# Altium project radxa_cm3i_io_board_v1.4.PrjPcb (part 1 of 4)
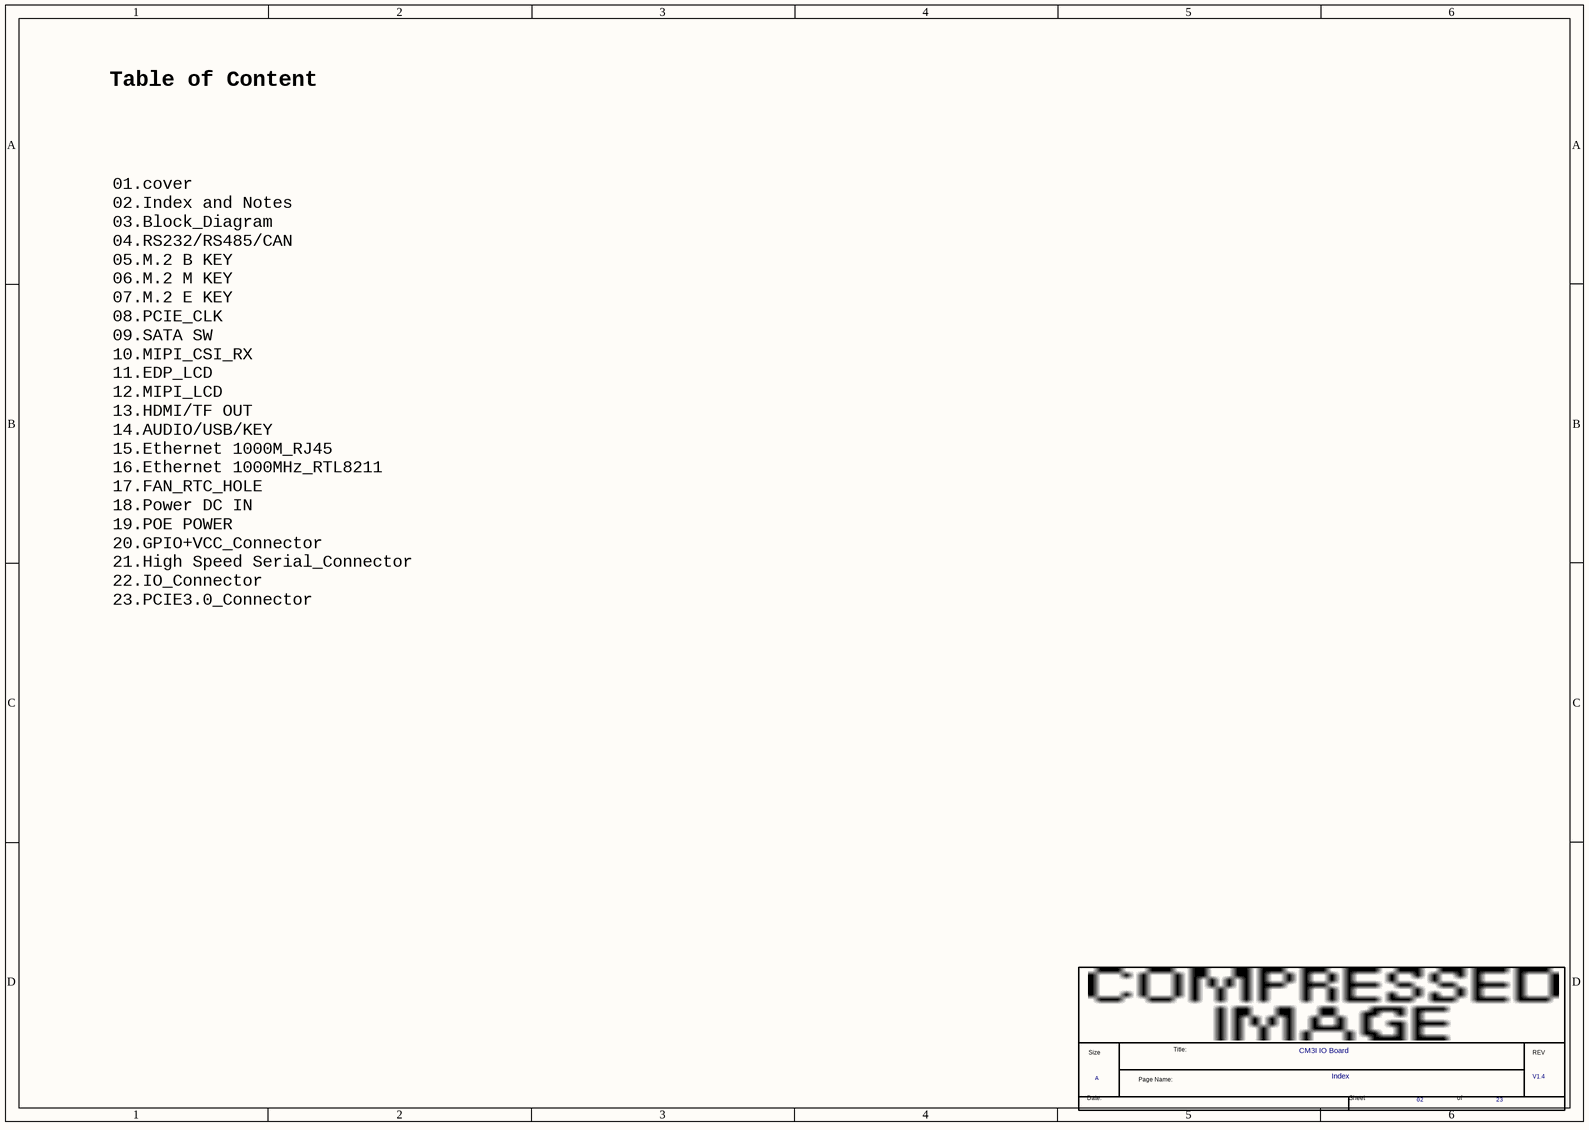
[diagram p0: 02.SchDoc]
23 sheets, 746 parts. Net scope: flat (ports and power ports of the same name join across sheets).
Sheets:
  01.SchDoc
  02.SchDoc
  03.SchDoc
  04.SchDoc
  05.SchDoc
  06.SchDoc
  07.SchDoc
  08.SchDoc
  09.SchDoc
  10.SchDoc
  11.SchDoc
  12.SchDoc
  13.SchDoc
  14.SchDoc
  15.SchDoc
  16.SchDoc
  17.SchDoc
  18.SchDoc
  19.SchDoc
  20.SchDoc
  21.SchDoc
  22.SchDoc
  23.SchDoc

## Sheet 01.SchDoc
size 297 x 209 mm

## Sheet 02.SchDoc
size 297 x 209 mm

### Parts
(Parts that share a designator on the sheet are numbered #1, #2 ... from top to bottom, then left to right.)
*#1  Page Count: 23  Page Number: 02  Page Size: A  Title: CM3I IO Board  RevCode: V1.4  Doc: Index  (hidden comment: radxa_1010)  (graphical)

### Notes on the sheet
- Table of Content
- 01.cover
  02.Index and Notes
  03.Block_Diagram
  04.RS232/RS485/CAN
  05.M.2 B KEY
  06.M.2 M KEY
  07.M.2 E KEY
  08.PCIE_CLK
  09.SATA SW
  10.MIPI_CSI_RX
  11.EDP_LCD
  12.MIPI_LCD
  13.HDMI/TF OUT
  14.AUDIO/USB/KEY
  15.Ethernet 1000M_RJ45
  16.Ethernet 1000MHz_RTL8211
  17.FAN_RTC_HOLE
  18.Power DC IN
  19.POE POWER
  20.GPIO+VCC_Connector
  21.High Speed Serial_Connector
  22.IO_Connector
  23.PCIE3.0_Connector
- (in symbol radxa_1010) Title:; Size; REV; Page Name:; Date:; Sheet; of

### Library data of the parts
*#1 = radxa_1010: Page Create Date: March  8, 1995

## Sheet 03.SchDoc
size 420 x 297 mm
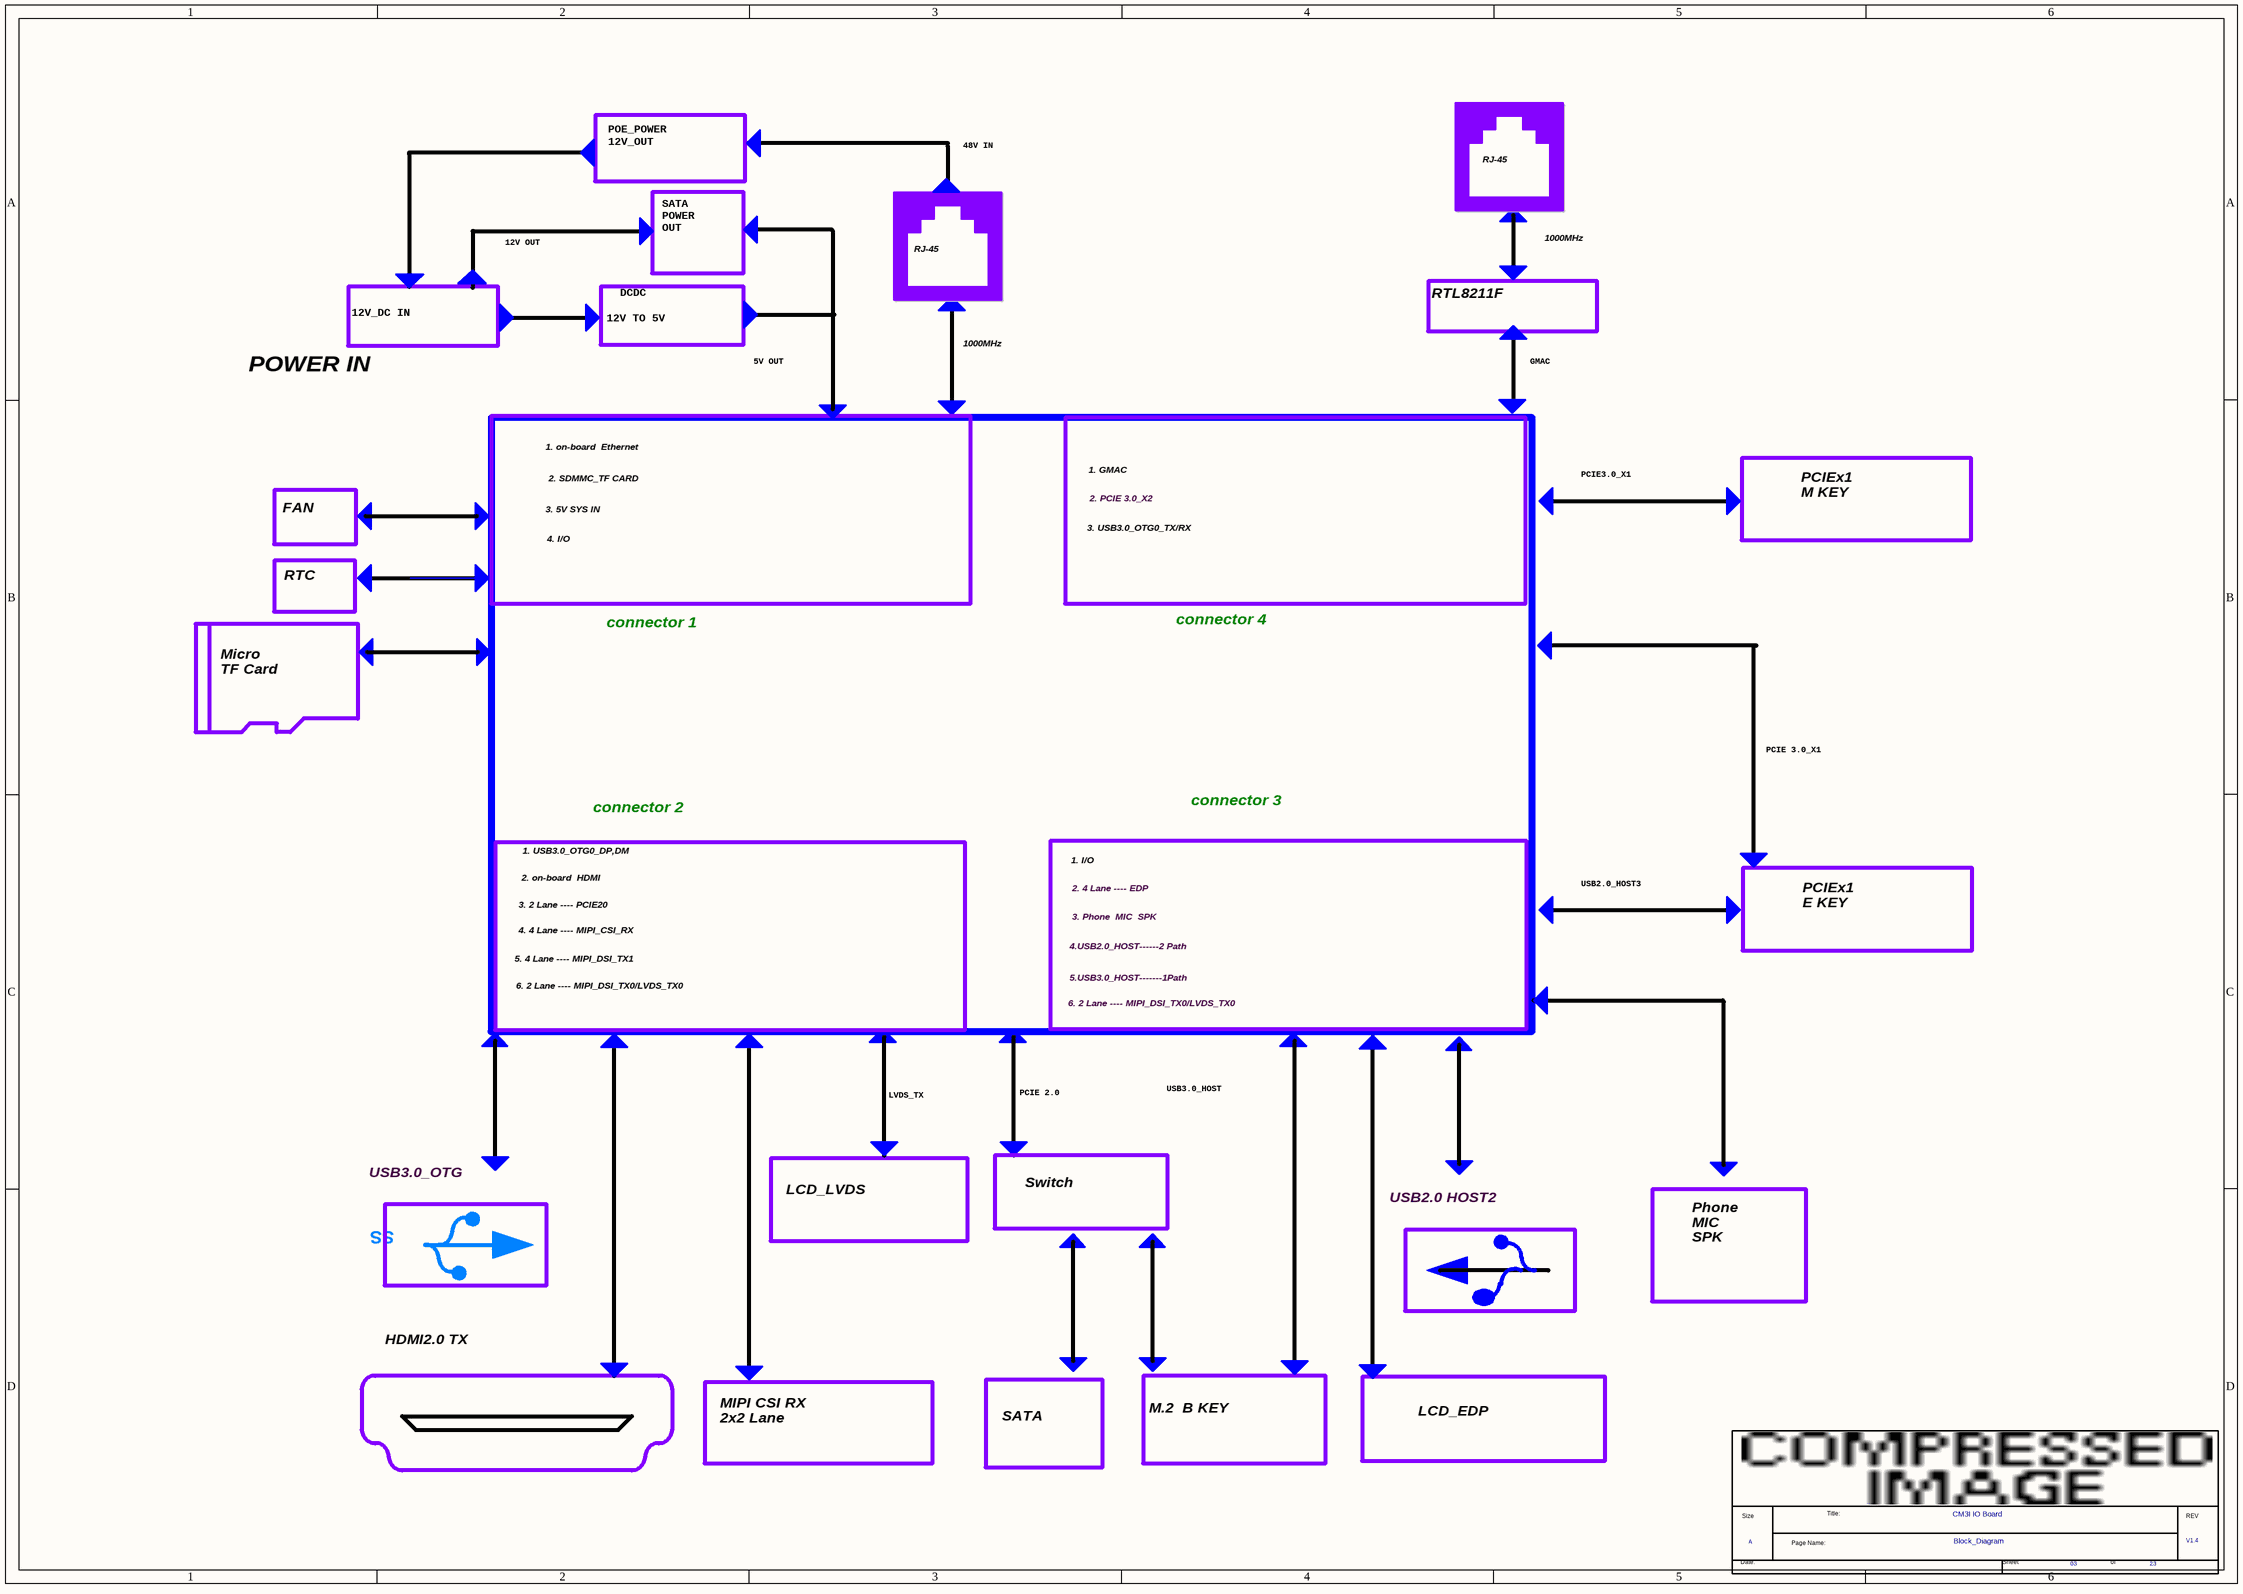
[diagram p1: 03.SchDoc]

### Parts
(Parts that share a designator on the sheet are numbered #1, #2 ... from top to bottom, then left to right.)
*#2  Page Count: 23  Page Number: 03  Page Size: A  Title: CM3I IO Board  RevCode: V1.4  Doc: Block_Diagram  (hidden comment: radxa_1010)  (graphical)

### Notes on the sheet
- POE_POWER
  12V_OUT
- SATA
  POWER
  OUT
- 48V IN
- RJ-45
- 12V OUT
- 1000MHz
- 12V_DC IN
- 12V TO 5V
- DCDC
- RTL8211F
- POWER IN
- 5V OUT
- GMAC
- 1. on-board  Ethernet
- PCIEx1
  M KEY
- FAN
- 3. 5V SYS IN
- 2. SDMMC_TF CARD
- 3. USB3.0_OTG0_TX/RX
- 1. GMAC
- 2. PCIE 3.0_X2
- PCIE3.0_X1
- RTC
- 4. I/O
- Micro
  TF Card
- connector 1
- connector 4
- PCIE 3.0_X1
- 1. USB3.0_OTG0_DP,DM
- connector 2
- 1. I/O
- connector 3
- 4. 4 Lane ---- MIPI_CSI_RX
- 3. 2 Lane ---- PCIE20
- 2. on-board  HDMI
- 2. 4 Lane ---- EDP
- 3. Phone  MIC  SPK
- USB2.0_HOST3
- PCIEx1
  E KEY
- 5. 4 Lane ---- MIPI_DSI_TX1
- 6. 2 Lane ---- MIPI_DSI_TX0/LVDS_TX0
- 4.USB2.0_HOST------2 Path
- 5.USB3.0_HOST-------1Path
- LVDS_TX
- PCIE 2.0
- USB3.0_HOST
- USB3.0_OTG
- LCD_LVDS
- Switch
- USB2.0 HOST2
- Phone
  MIC
  SPK
- SS
- HDMI2.0 TX
- MIPI CSI RX
  2x2 Lane
- SATA
- M.2  B KEY
- LCD_EDP
- (in symbol radxa_1010) Title:; Size; REV; Page Name:; Date:; Sheet; of

### Library data of the parts
*#2 = radxa_1010: Page Create Date: March  8, 1995

## Sheet 04.SchDoc
size 420 x 297 mm
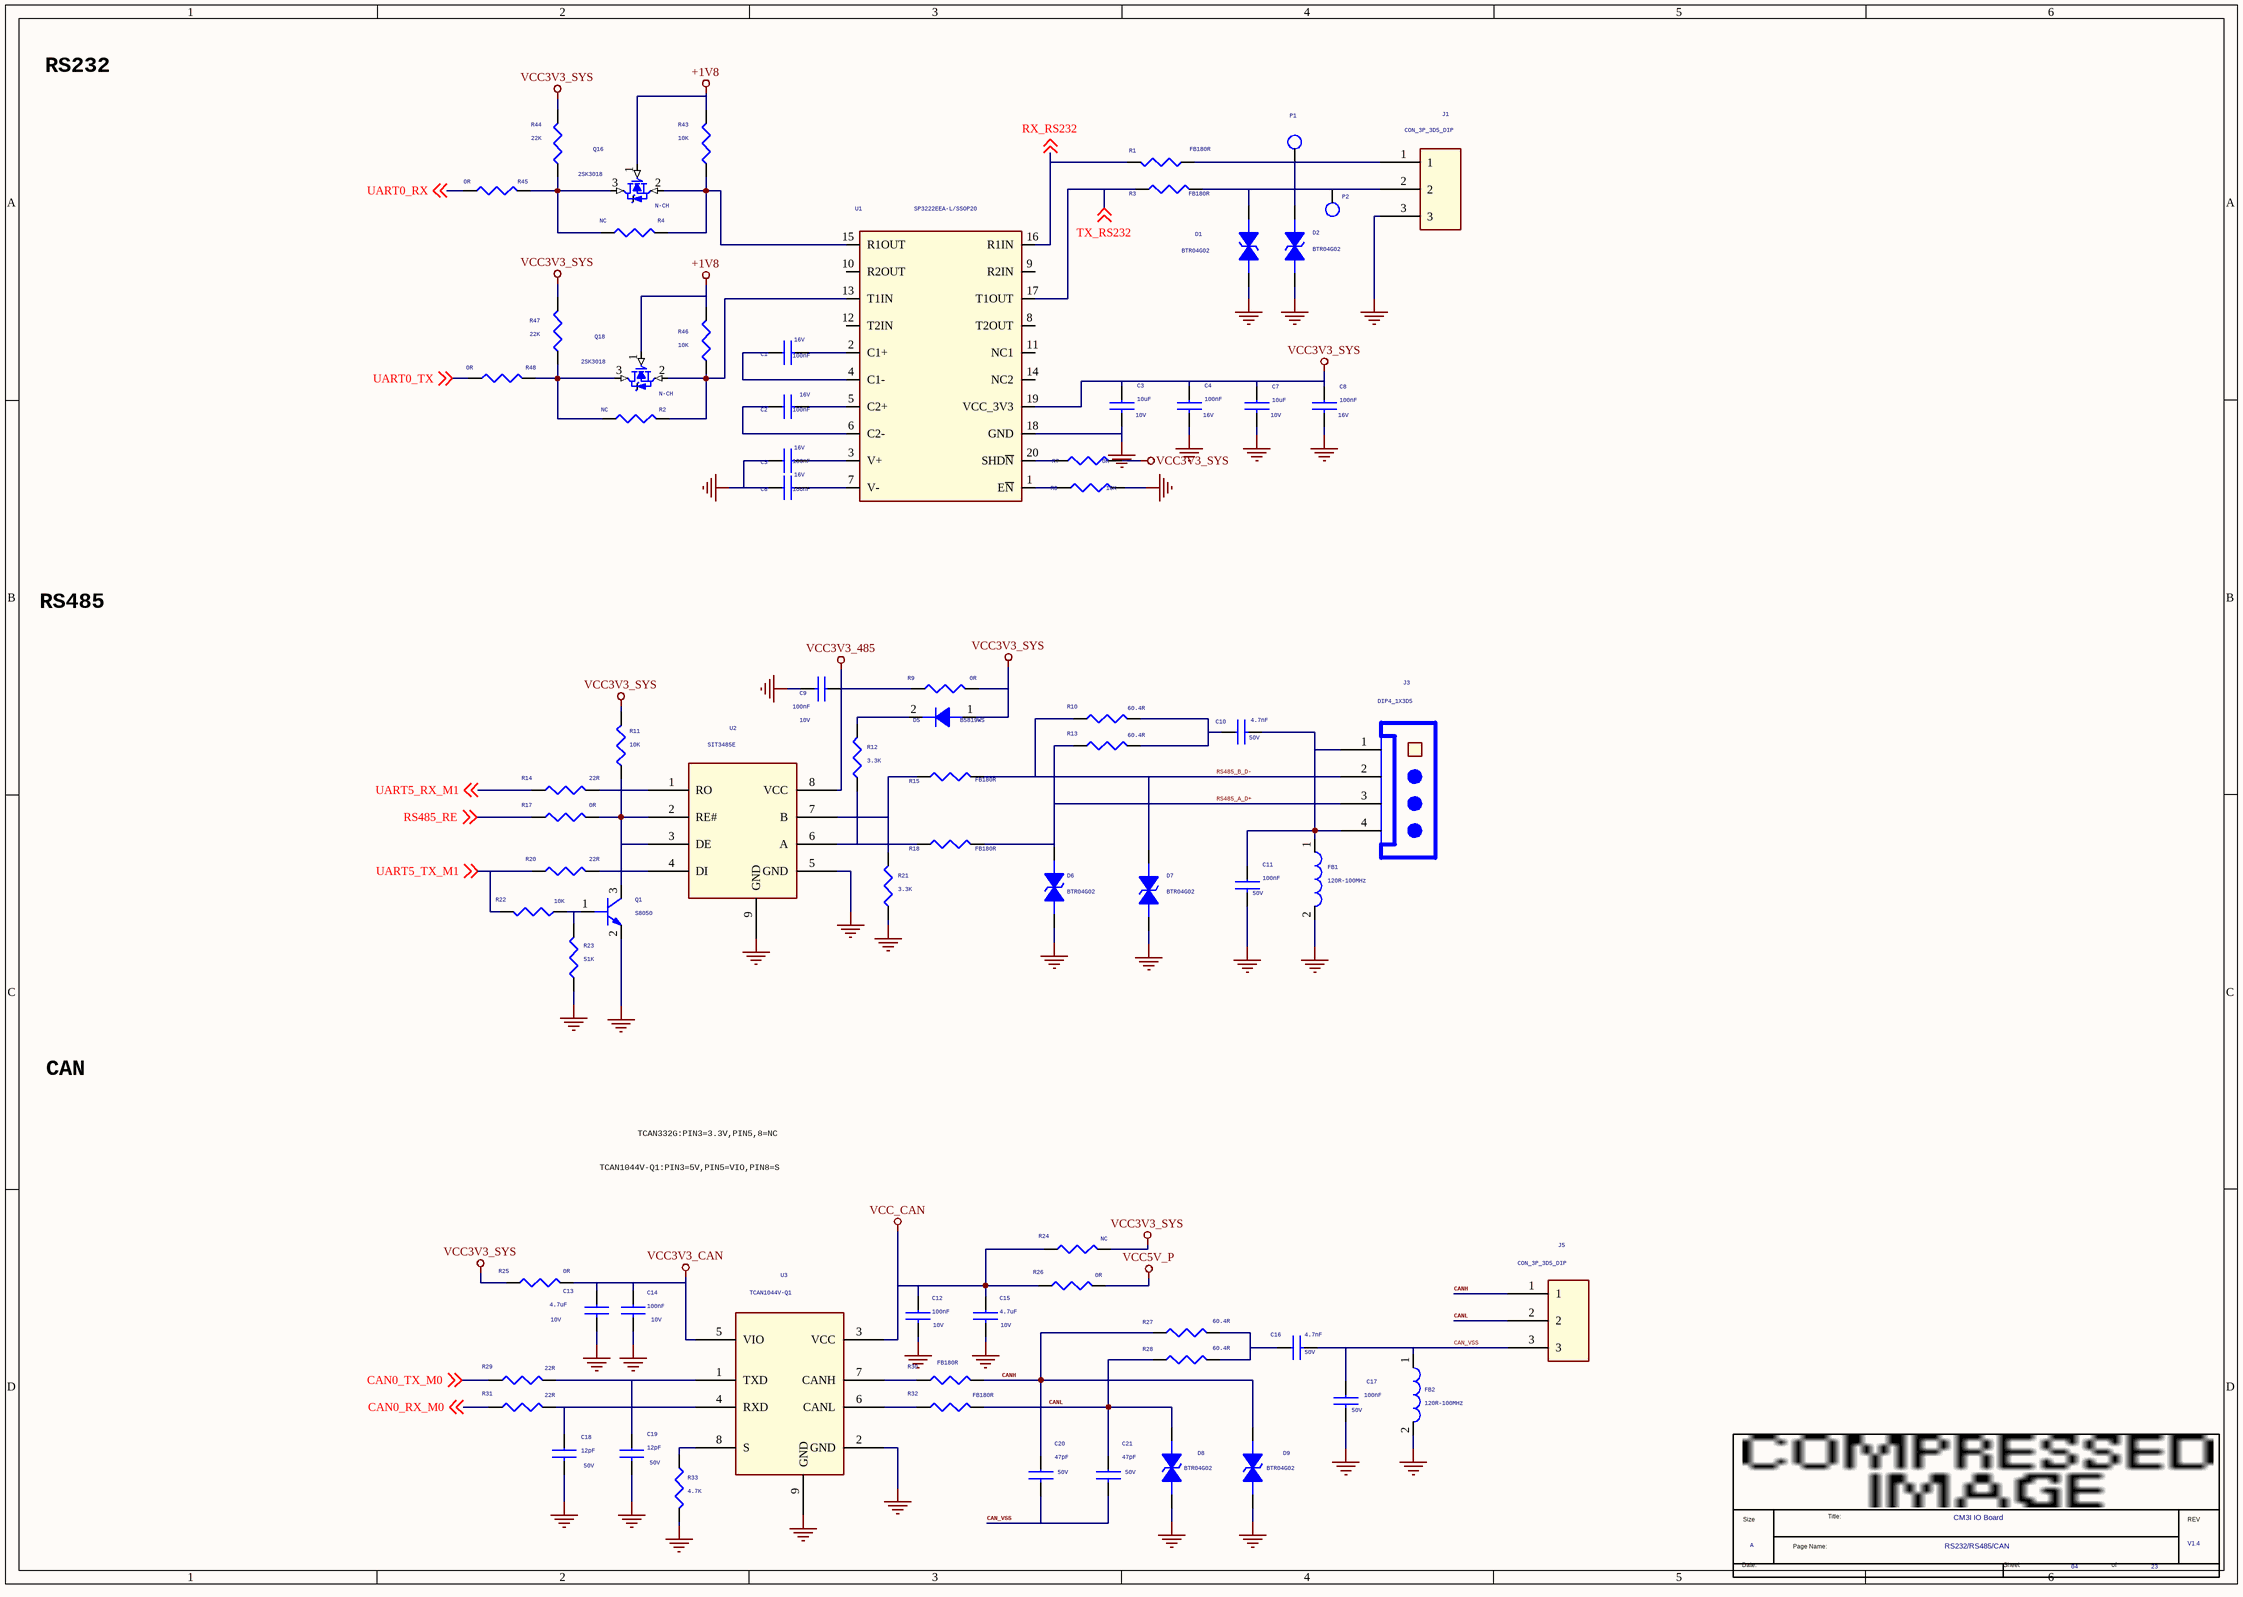
[diagram p2: 04.SchDoc]

### Parts
(Parts that share a designator on the sheet are numbered #1, #2 ... from top to bottom, then left to right.)
*#3  Page Count: 23  Page Number: 04  Page Size: A  Title: CM3I IO Board  RevCode: V1.4  Doc: RS232/RS485/CAN  (hidden comment: radxa_1010)  (graphical)
C1  100nF  Voltage: 16V  [C0402]
C2  100nF  Voltage: 16V  [C0402]
C3  10uF  Voltage: 10V  [C0603]
C4  100nF  Voltage: 16V  [C0402]
C5  100nF  Voltage: 16V  [C0402]
C6  100nF  Voltage: 16V  [C0402]
C7  10uF  Voltage: 10V  [C0603]
C8  100nF  Voltage: 16V  [C0402]
C9  100nF  Voltage: 10V  [C0402]
C10  4.7nF  Voltage: 50V  [C0402]
C11  100nF  Voltage: 50V  [C0603]
C12  100nF  Voltage: 10V  [C0402]
C13  4.7uF  Voltage: 10V  [C0603]
C14  100nF  Voltage: 10V  [C0402]
C15  4.7uF  Voltage: 10V  [C0603]
C16  4.7nF  Voltage: 50V  [C0402]
C17  100nF  Voltage: 50V  [C0603]
C18  12pF  Voltage: 50V  [C0402]
C19  12pF  Voltage: 50V  [C0402]
C20  47pF  Voltage: 50V  [C0402]
C21  47pF  Voltage: 50V  [C0402]
D1  BTR04G02  [ESD0402_1xD5]
D2  BTR04G02  [ESD0402_1xD5]
D5  B5819WS  [SOD_323]
D6  BTR04G02  [ESD0402_1xD5]
D7  BTR04G02  [ESD0402_1xD5]
D8  BTR04G02  [ESD0402_1xD5]
D9  BTR04G02  [ESD0402_1xD5]
FB1  120R-100MHz  [L0603]
FB2  120R-100MHz  [L0603]
J1  CON_3P_3D5_DIP  [DIP3_1X3_2R54]
J3  DIP4_1X3D5  [DIP4_1X3D5]
J5  CON_3P_3D5_DIP  [DIP3_1X3_2R54]
P1  TEST  [TEST]  (value not drawn)
P2  TEST  [TEST]  (value not drawn)
Q1  S8050  [SOT_23]
Q16  2SK3018  [S0T-23]
Q18  2SK3018  [S0T-23]
R1  FB180R  [R0402]
R2  NC  [R0402]
R3  FB180R  [R0402]
R4  NC  [R0402]
R7  0R  [R0402]
R8  10K  [R0402]
R9  0R  [R0402]
R10  60.4R  [R0402]
R11  10K  [R0402]
R12  3.3K  [R0402]
R13  60.4R  [R0402]
R14  22R  [R0402]
R15  FB180R  [R0402]
R17  0R  [R0402]
R18  FB180R  [R0402]
R20  22R  [R0402]
R21  3.3K  [R0402]
R22  10K  [R0402]
R23  51K  [R0402]
R24  NC  [R0402]
R25  0R  [R0402]
R26  0R  [R0402]
R27  60.4R  [R0402]
R28  60.4R  [R0402]
R29  22R  [R0402]
R30  FB180R  [R0402]
R31  22R  [R0402]
R32  FB180R  [R0402]
R33  4.7K  [R0402]
R43  10K  [R0402]
R44  22K  [R0402]
R45  0R  [R0402]
R46  10K  [R0402]
R47  22K  [R0402]
R48  0R  [R0402]
U1  SP3222EEA-L/SSOP20  [SSOP20_1]
U2  SIT3485E  [SOP8_5R00X4R00X1R75_T]
U3  TCAN1044V-Q1  [SOP8_5R00X4R00X1R75_T]

### Nets
+1V8: Q16.1(G) Q18.1(G) R43.1 R46.1
GND: C3.2 C4.2 C5.1 C6.1 C7.2 C8.2 C9.2 C11.2 C12.2 C13.2 C14.2 C15.2 C17.2 C18.2 C19.2 D1.1 D2.1 D6.1 D7.1 D8.1 D9.1 FB1.2 FB2.2 J1.3 Q1.2(EMITTER) R8.2 R21.2 R23.2 R33.2 U1.18(GND) U2.5(GND) U2.9(GND) U3.2(GND) U3.9(GND)
VCC3V3_485: C9.1 R9.1 U2.8(VCC)
VCC3V3_CAN: C13.1 C14.1 R25.2 U3.5(VIO)
VCC3V3_SYS: C3.1 C4.1 C7.1 C8.1 D5.1(A) R7.1 R9.2 R11.1 R24.2 R25.1 R44.1 R47.1 U1.19(VCC_3V3)
VCC5V_P: R26.2
VCC_CAN: C12.1 C15.1 R24.1 R26.1 U3.3(VCC)
CAN0_RX_M0: R31.1 ; off-sheet CAN0_RX_M0
CAN0_TX_M0: R29.1 ; off-sheet CAN0_TX_M0
CAN_VSS: C16.2 C17.1 C20.2 C21.2 FB2.1 J5.3
CANH: C20.1 D9.2 J5.1 R27.1 R30.2
CANL: C21.1 D8.2 J5.2 R28.1 R32.2
RS485_A_D+: D6.2 J3.3(TX) R13.1 R18.2
RS485_B_D-: D7.2 J3.2(RX) R10.1 R15.2
RS485_RE: R17.1 ; off-sheet RS485_RE
RX_RS232: R1.2 U1.16(R1IN) ; off-sheet RX_RS232
TX_RS232: R3.2 U1.17(T1OUT) ; off-sheet TX_RS232
UART0_RX: R45.2 ; off-sheet UART0_RX
UART0_TX: R48.2 ; off-sheet UART0_TX
UART5_RX_M1: R14.1 ; off-sheet UART5_RX_M1
UART5_TX_M1: R20.1 R22.1 ; off-sheet UART5_TX_M1
NetC1_1: C1.1 U1.4(C1-)
NetC1_2: C1.2 U1.2(C1+)
NetC2_1: C2.1 U1.6(C2-)
NetC2_2: C2.2 U1.5(C2+)
NetC5_2: C5.2 U1.3(V+)
NetC6_2: C6.2 U1.7(V-)
NetC10_1: C10.1 R10.2 R13.2
NetC10_2: C10.2 C11.1 FB1.1 J3.1(GND) J3.4(3V3)
NetC16_1: C16.1 R27.2 R28.2
NetC18_1: C18.1 R31.2 U3.4(RXD)
NetC19_1: C19.1 R29.2 U3.1(TXD)
NetD1_2: D1.2 J1.2 P2.1 R3.1
NetD2_2: D2.2 J1.1 P1.1 R1.1
NetD5_2: D5.2(K) R12.1
NetQ1_1: Q1.1(BASE) R22.2 R23.1
NetQ1_3: Q1.3(COLLECTOR) R11.2 R17.2 U2.2(RE#) U2.3(DE)
NetQ16_2: Q16.2(S) R4.1 R43.2 U1.15(R1OUT)
NetQ16_3: Q16.3(D) R4.2 R44.2 R45.1
NetQ18_2: Q18.2(S) R2.1 R46.2 U1.13(T1IN)
NetQ18_3: Q18.3(D) R2.2 R47.2 R48.1
NetR7_2: R7.2 U1.20(SHD~{N})
NetR8_1: R8.1 U1.1(E~{N})
NetR12_2: R12.2 R18.1 U2.6(A)
NetR14_2: R14.2 U2.1(RO)
NetR15_1: R15.1 R21.1 U2.7(B)
NetR20_2: R20.2 U2.4(DI)
NetR30_1: R30.1 U3.7(CANH)
NetR32_1: R32.1 U3.6(CANL)
NetR33_1: R33.1 U3.8(S)

Not connected (* = marked no-connect by the designer): U1 8(T2OUT) 9(R2IN) 10(R2OUT) 11(NC1) 12(T2IN) 14(NC2)

### Notes on the sheet
- RS232
- RS485
- CAN
- TCAN332G:PIN3=3.3V,PIN5,8=NC
- TCAN1044V-Q1:PIN3=5V,PIN5=VIO,PIN8=S
- (in symbol N-MOSFET) N-CH
- (in symbol radxa_1010) Size; Title:; REV; Page Name:; Date:; Sheet; of

### Library data of the parts
C1 C2 = CAP NP_0: cap,100.00nF,+/-10%,16V,X5R,C0402; Manufacturer: TDK; RK PN: C1005X5R1C104K050BA; Priority: A; Tolerance: 10%; Dielectric: X5R; Part Type: C0402; Manufacturer PN: C1005X5R1C104K050BA; Created by: JJJ
C3 C15 = CAP NP_0: cap,4.70uF,+/-10%,10V,X5R,C0603; Manufacturer: TDK; RK PN: C1608X5R1A475K080AC; Priority: A; Tolerance: 10%; Dielectric: X5R; Part Type: C0603; Manufacturer PN: C1608X5R1A475K080AC; Created by: JJJ
C4-C6 C8 = CAP NP_0: cap,100.00nF,+/-10%,16V,X5R,C0402; Manufacturer PN: C1005X5R1C104K050BA; Manufacturer: TDK; Tolerance: 10%; Priority: A; Dielectric: X5R; Created by: JJJ; Part Type: C0402; RK PN: C1005X5R1C104K050BA
C7 = CAP NP_0: cap,4.70uF,+/-10%,10V,X5R,C0603; Manufacturer PN: C1608X5R1A475K080AC; Manufacturer: TDK; Tolerance: 10%; Priority: A; Dielectric: X5R; Created by: JJJ; Part Type: C0603; RK PN: C1608X5R1A475K080AC
C9 = CAP NP_0: cap,100.00nF,+/-10%,10V,X5R,C0402; Manufacturer: TDK; Number: 37; RK PN: C1005X5R1A104K050BA; Priority: A; Tolerance: 10%; C_Voltage: 6.3V; Dielectric: X5R; Part Type: C0402; Manufacturer PN: C1005X5R1A104K050BA; Created by: JJJ
C10 C16 = CAP NP_0: cap,4.70nF,+/-10%,50V,X5R,C0402; Manufacturer PN: C1005X5R1H472K050BA; Manufacturer: TDK; Tolerance: 10%; Priority: A; Dielectric: X5R; Created by: JJJ; C_Voltage: 50V; Part Type: C0402; RK PN: C1005X5R1H472K050BA
C11 = CAP NP_0: cap,100.00nF,+/-10%,50V,X5R,C0603; Manufacturer: TDK; RK PN: C1608X5R1H104K080AA; Priority: A; C_Voltage: 6.3V; Tolerance: 10%; Dielectric: X5R; Part Type: C0603; Manufacturer PN: C1608X5R1H104K080AA; Created by: JJJ
C12 C14 = CAP NP_0: cap,100.00nF,+/-10%,10V,X5R,C0402; Manufacturer PN: C1005X5R1A104K050BA; Manufacturer: TDK; Tolerance: 10%; Priority: A; Dielectric: X5R; Created by: JJJ; Part Type: C0402; RK PN: C1005X5R1A104K050BA
C13 = CAP NP_0: cap,4.70uF,+/-10%,10V,X5R,C0603; Manufacturer: TDK; RK PN: C1608X5R1A475K080AC; Tolerance: 10%; Priority: A; Dielectric: X5R; Created by: JJJ; Part Type: C0603; Manufacturer PN: C1608X5R1A475K080AC
C17 = CAP NP_0: cap,100.00nF,+/-10%,50V,X5R,C0603; Manufacturer PN: C1608X5R1H104K080AA; Manufacturer: TDK; Tolerance: 10%; C_Voltage: 6.3V; Priority: A; Dielectric: X5R; Created by: JJJ; Part Type: C0603; RK PN: C1608X5R1H104K080AA
C18 C19 = CAP NP_0: cap,12.00pF,+/-5%,50V,C0G,C0402; Manufacturer PN: C1005C0G1H120J050BA; Manufacturer: TDK; Tolerance: 5%; Priority: A; OPTION: DNP; Dielectric: C0G; Created by: JJJ; C_Voltage: 50V; Part Type: C0402; RK PN: C1005C0G1H120J050BA
C20 C21 = CAP NP_0: cap,47.00pF,+/-5%,50V,C0G,C0402; Manufacturer: TDK; RK PN: C1005C0G1H470J050BA; Priority: A; Tolerance: 5%; OPTION: DNP; Dielectric: C0G; Part Type: C0402; C_Voltage: 50V; Manufacturer PN: C1005C0G1H470J050BA; Created by: JJJ
D1 D2 D8 D9 = DIODE BI_DIR TRIG_0: 1-Line, Bi-directional, Transient Voltage Suppressors.17.5pF.; Manufacturer: WillSemi(韦尔半导体); RK PN: ESD5451N; Priority: A; OPTION: DNP; Part Type: ESD_TVS; Manufacturer PN: ESD5451N; Created by: JJJ
D5 = DIODE_Dup2: Schottky Barrier，B5819WS SOD-323; Manufacturer: 长电; Priority: A; RK PN: B5819WS; Part Type: Schottky rectifier; Manufacturer PN: B5819WS; Created by: JJJ
D6 D7 = DIODE BI_DIR TRIG_0: 1-Line, Bi-directional, Transient Voltage Suppressors.17.5pF.; Manufacturer PN: ESD5451N; Manufacturer: WillSemi(韦尔半导体); OPTION: DNP; Priority: A; Created by: JJJ; Part Type: ESD_TVS; RK PN: ESD5451N
FB1 FB2 = BEAD: BEAD,120R@100MHz,current=2000mA,0603; Manufacturer PN: BLM18KG121TN1; Manufacturer: Murata; DC Resistor: 0.030ohm; Tolerance: 25%; Irms: 2A; Priority: L; Created by: DZS; Part Type: BEAD; RK PN: BLM18KG121TN1
J1 J5 = CON3_1X3: 单排3PIN（间距2.54mm）不带防护墙的插针; RK PN: CON3M_1X3_2R54_V; Priority: A; Part Type: Header; Manufacturer Part Number: CON3M_1X3_2R54_V; Created by: JJJ
J3 = CON4_0
P1 P2 = TESTPOINT1
Q1 = NPN: S8050,SOT23; Manufacturer: 长电; Manufacturer PN: S8050_SOT23; OPTION: DNP; Priority: A; Ic: 0.5A; Vceo: 25V; Pc: 0.3W; RK PN: S8050; Part Type: NPN; Created by: JJJ
Q16 Q18 = N-MOSFET: SANZ_P/N: SK2300; Part Type: MOS管
R1 R14 = RESISTOR_0_Dup1: 通用厚膜电阻,22R,+/-5%,R0402,1/16W.; Manufacturer PN: RC0402JR-0722RL; Manufacturer: YAGEO; Tolerance: 5%; Wattage: 1/16W; Priority: A; Created by: YTL; Part Type: 通用厚膜电阻; RK PN: RC0402JR-0722RL
R2 R4 = RESISTOR_2: 通用厚膜电阻,22R,+/-5%,R0402,1/16W.; Manufacturer: YAGEO; Tolerance: 5%; RK PN: RC0402JR-0722RL; Priority: A; Wattage: 1/16W; Part Type: 通用厚膜电阻; Manufacturer PN: RC0402JR-0722RL; Created by: YTL
R3 R7 R20 R29 R31 = RESISTOR_0_Dup1: 通用厚膜电阻,22R,+/-5%,R0402,1/16W.; Manufacturer: YAGEO; Tolerance: 5%; RK PN: RC0402JR-0722RL; Priority: A; Wattage: 1/16W; Part Type: 通用厚膜电阻; Manufacturer PN: RC0402JR-0722RL; Created by: YTL
R8 = RESISTOR_0_Dup1: 通用厚膜电阻,10K,+/-5%,R0402,1/16W.; Manufacturer PN: RC0402JR-0710KL; Manufacturer: YAGEO; Tolerance: 5%; Wattage: 1/16W; Priority: A; Created by: YTL; Part Type: 通用厚膜电阻; RK PN: RC0402JR-0710KL
R9 R26 = RESISTOR_0_Dup1: 通用厚膜电阻,0R,+/-5%,R0402,1/16W.; Manufacturer PN: RC0402JR-070RL; Manufacturer: YAGEO; Tolerance: 5%; Wattage: 1/16W; Priority: A; Created by: YTL; Part Type: 通用厚膜电阻; RK PN: RC0402JR-070RL
R10 R28 = RESISTOR_0_Dup1: 通用厚膜电阻,60R4,+/-1%,R1206,1/4W.; Manufacturer: YAGEO; Tolerance: 1%; RK PN: RC1206FR-0760R4L; Priority: A; Wattage: 1/4W; Part Type: 通用厚膜电阻; Manufacturer PN: RC1206FR-0760R4L; Created by: YTL
R11 = RESISTOR_0_Dup1: 通用厚膜电阻,10K,+/-5%,R0402,1/16W.; Manufacturer PN: RC0402JR-0710KL; Manufacturer: YAGEO; Tolerance: 5%; Wattage: 1/16W; Priority: A; OPTION: DNP; Created by: YTL; Part Type: 通用厚膜电阻; RK PN: RC0402JR-0710KL
R12 = RESISTOR_0_Dup1: 通用厚膜电阻,3K3,+/-5%,R0402,1/16W.; Manufacturer: YAGEO; Tolerance: 5%; RK PN: RC0402JR-073K3L; Priority: A; Wattage: 1/16W; Part Type: 通用厚膜电阻; Manufacturer PN: RC0402JR-073K3L; Created by: YTL
R13 R27 = RESISTOR_0_Dup1: 通用厚膜电阻,60R4,+/-1%,R1206,1/4W.; Manufacturer PN: RC1206FR-0760R4L; Manufacturer: YAGEO; Tolerance: 1%; Wattage: 1/4W; Priority: A; Created by: YTL; Part Type: 通用厚膜电阻; RK PN: RC1206FR-0760R4L
R15 R18 = RESISTOR_0_Dup1: 通用厚膜电阻,0R,+/-5%,R0805,1/8W.; Manufacturer: YAGEO; Tolerance: 5%; RK PN: RC0805JR-070RL; Priority: A; Wattage: 1/8W; Part Type: 通用厚膜电阻; Manufacturer PN: RC0805JR-070RL; Created by: YTL
R17 R25 = RESISTOR_0_Dup1: 通用厚膜电阻,0R,+/-5%,R0402,1/16W.; Manufacturer: YAGEO; Tolerance: 5%; RK PN: RC0402JR-070RL; Priority: A; Wattage: 1/16W; Part Type: 通用厚膜电阻; Manufacturer PN: RC0402JR-070RL; Created by: YTL
R21 = RESISTOR_0_Dup1: 通用厚膜电阻,3K3,+/-5%,R0402,1/16W.; Manufacturer PN: RC0402JR-073K3L; Manufacturer: YAGEO; Tolerance: 5%; Wattage: 1/16W; Priority: A; Created by: YTL; Part Type: 通用厚膜电阻; RK PN: RC0402JR-073K3L
R22 = RESISTOR_0_Dup1: 通用厚膜电阻,10K,+/-5%,R0402,1/16W.; Manufacturer: YAGEO; Tolerance: 5%; OPTION: DNP; RK PN: RC0402JR-0710KL; Priority: A; Wattage: 1/16W; Part Type: 通用厚膜电阻; Manufacturer PN: RC0402JR-0710KL; Created by: YTL
R23 = RESISTOR_0_Dup1: 通用厚膜电阻,51K,+/-5%,R0402,1/16W.; Manufacturer PN: RC0402JR-0751KL; Manufacturer: YAGEO; Tolerance: 5%; OPTION: DNP; Wattage: 1/16W; Priority: A; Created by: YTL; Part Type: 通用厚膜电阻; RK PN: RC0402JR-0751KL
R24 = RESISTOR_0_Dup1: 通用厚膜电阻,0R,+/-5%,R0402,1/16W.; Manufacturer PN: RC0402JR-070RL; Manufacturer: YAGEO; Tolerance: 5%; OPTION: DNP; Wattage: 1/16W; Priority: A; Created by: YTL; Part Type: 通用厚膜电阻; RK PN: RC0402JR-070RL
R30 R32 = RESISTOR_0_Dup1: 通用厚膜电阻,0R,+/-5%,R0805,1/8W.; Manufacturer PN: RC0805JR-070RL; Manufacturer: YAGEO; Tolerance: 5%; Wattage: 1/8W; Priority: A; Created by: YTL; Part Type: 通用厚膜电阻; RK PN: RC0805JR-070RL
R33 = RESISTOR_0_Dup1: 通用厚膜电阻,4K7,+/-5%,R0402,1/16W.; Manufacturer: YAGEO; Tolerance: 5%; RK PN: RC0402JR-074K7L; Priority: A; Wattage: 1/16W; Part Type: 通用厚膜电阻; Manufacturer PN: RC0402JR-074K7L; Created by: YTL
R43 = RESISTOR_0: 通用厚膜电阻,10K,+/-5%,R0402,1/16W.; Manufacturer: YAGEO; Tolerance: 5%; RK PN: RC0402JR-0710KL; Priority: A; Wattage: 1/16W; Part Type: 通用厚膜电阻; Manufacturer PN: RC0402JR-0710KL; Created by: YTL
R44 = RESISTOR_0: 通用厚膜电阻,1K5,+/-5%,R0402,1/16W.; Manufacturer PN: RC0402JR-071K5L; Manufacturer: YAGEO; Tolerance: 5%; Wattage: 1/16W; Priority: A; Created by: YTL; Part Type: 通用厚膜电阻; RK PN: RC0402JR-071K5L
R45 R48 = RESISTOR_2: 通用厚膜电阻,22R,+/-5%,R0402,1/16W.; Manufacturer PN: RC0402JR-0722RL; Manufacturer: YAGEO; Tolerance: 5%; Wattage: 1/16W; Priority: A; Created by: YTL; Part Type: 通用厚膜电阻; RK PN: RC0402JR-0722RL
R46 = RESISTOR_0: 通用厚膜电阻,10K,+/-5%,R0402,1/16W.; Manufacturer PN: RC0402JR-0710KL; Manufacturer: YAGEO; Tolerance: 5%; Wattage: 1/16W; Priority: A; Created by: YTL; Part Type: 通用厚膜电阻; RK PN: RC0402JR-0710KL
R47 = RESISTOR_0: 通用厚膜电阻,1K5,+/-5%,R0402,1/16W.; Manufacturer: YAGEO; Tolerance: 5%; RK PN: RC0402JR-071K5L; Priority: A; Wattage: 1/16W; Part Type: 通用厚膜电阻; Manufacturer PN: RC0402JR-071K5L; Created by: YTL
U1 = XR21V1410_0
U2 = MAX3485_0
U3 = TJA1051T_0
*#3 = radxa_1010: Page Create Date: March  8, 1995

## Sheet 05.SchDoc
size 297 x 209 mm
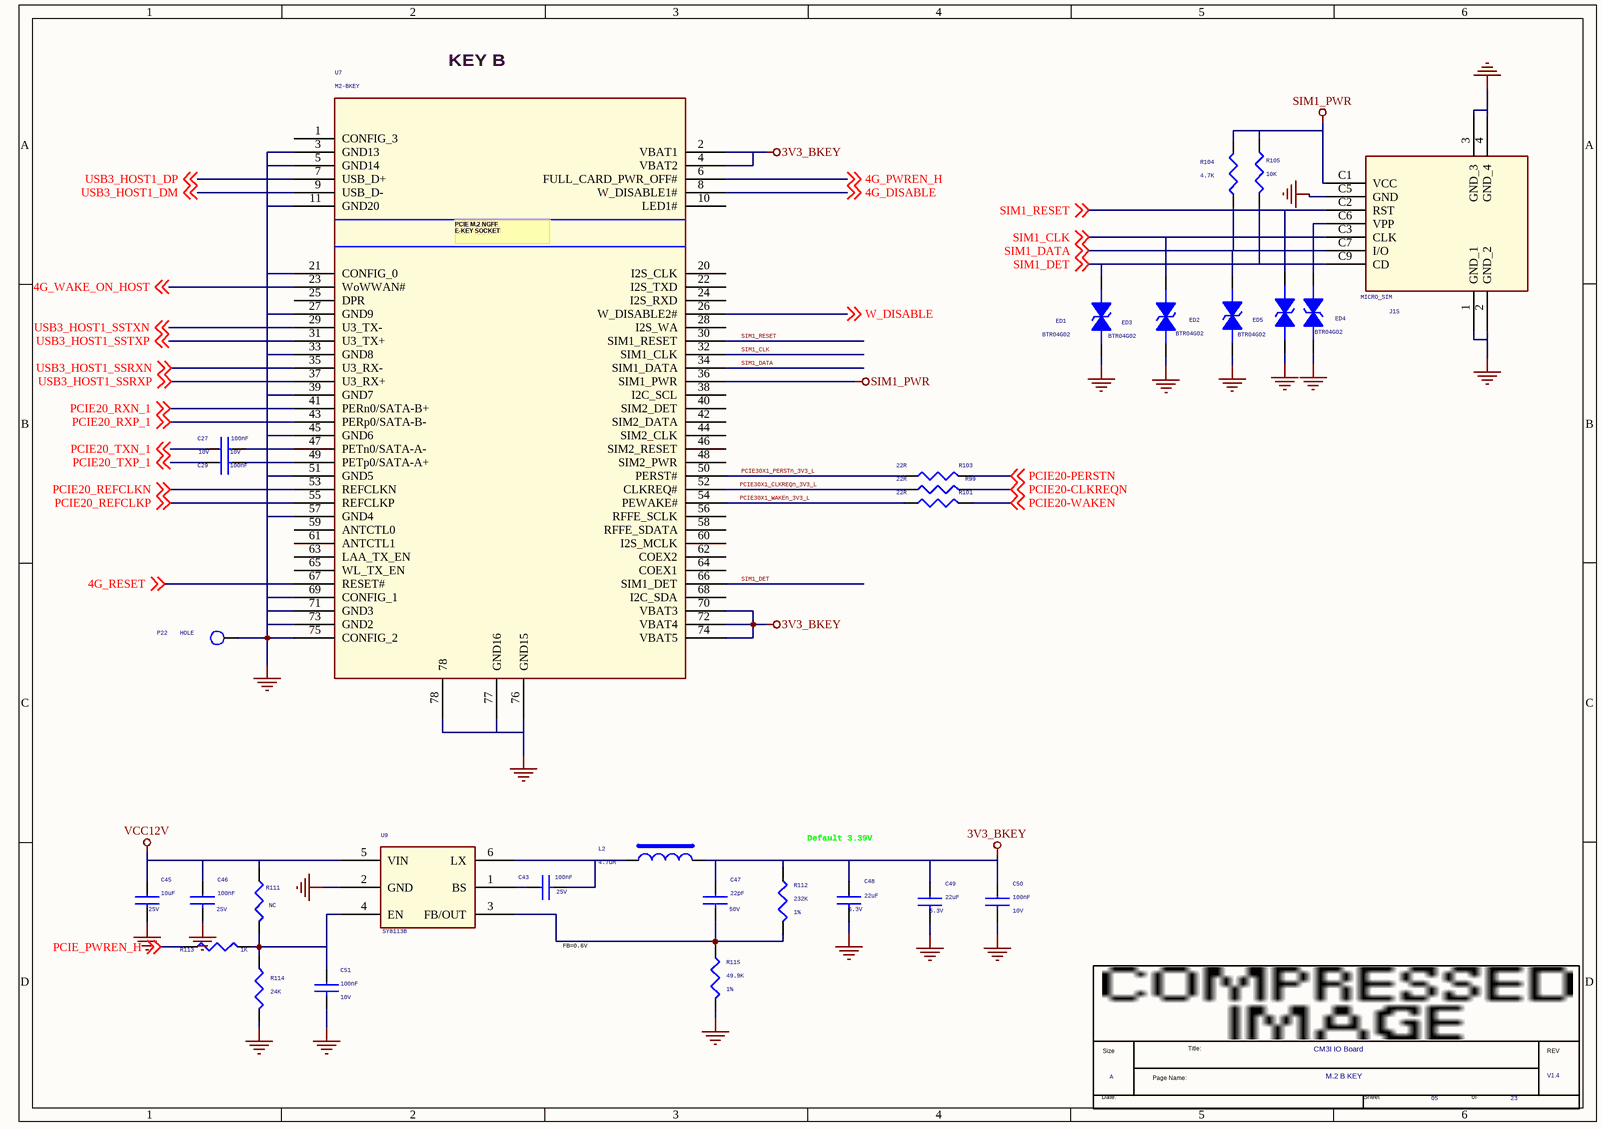
[diagram p3: 05.SchDoc]

### Parts
(Parts that share a designator on the sheet are numbered #1, #2 ... from top to bottom, then left to right.)
*#4  Page Count: 23  Page Number: 05  Page Size: A  Title: CM3I IO Board  RevCode: V1.4  Doc: M.2 B KEY  (hidden comment: radxa_1010)  (graphical)
C27  100nF  Voltage: 10V  [C0402]
C29  100nF  Voltage: 10V  [C0402]
C43  100nF  Voltage: 25V  [C0402]
C45  10uF  Voltage: 25V  [C1206]
C46  100nF  Voltage: 25V  [C0402]
C47  22pF  Voltage: 50V  [C0402]
C48  22uF  Voltage: 6.3V  [C0603]
C49  22uF  Voltage: 6.3V  [C0603]
C50  100nF  Voltage: 10V  [C0402]
C51  100nF  Voltage: 10V  [C0402]
ED1  BTR04G02  [ESD0402_1xD5]
ED2  BTR04G02  [ESD0402_1xD5]
ED3  BTR04G02  [ESD0402_1xD5]
ED4  BTR04G02  [ESD0402_1xD5]
ED5  BTR04G02  [ESD0402_1xD5]
J15  MICRO_SIM  [SIM-SPPN08-X0-1X80]
L2  4.7uH  [IND-4X4]
P22  HOLE  [TEST]
R99  22R  [R0402]
R101  22R  [R0402]
R103  22R  [R0402]
R104  4.7K  [R0402]
R105  10K  [R0402]
R111  NC  [R0402]
R112  232K  Tolerance: 1%  [R0402]
R113  1K  [R0402]
R114  24K  [R0402]
R115  49.9K  Tolerance: 1%  [R0402]
U7  M2-BKEY  [M2_NGFF_KEY_B-GX]
U9  SY8113B  [SOT_23_6]

### Nets
3V3_BKEY: C47.1 C48.1 C49.1 C50.1 L2.2 R112.1 U7.2(VBAT1) U7.4(VBAT2) U7.70(VBAT3) U7.72(VBAT4) U7.74(VBAT5)
GND: C45.2 C46.2 C48.2 C49.2 C50.2 C51.2 ED1.2 ED2.2 ED3.2 ED4.2 ED5.2 J15.1(GND_1) J15.2(GND_2) J15.3(GND_3) J15.4(GND_4) J15.C5(GND) P22.1 R114.2 R115.2 U7.3(GND13) U7.5(GND14) U7.11(GND20) U7.21(CONFIG_0) U7.27(GND9) U7.33(GND8) U7.39(GND7) U7.45(GND6) U7.51(GND5) U7.57(GND4) U7.69(CONFIG_1) U7.71(GND3) U7.73(GND2) U7.75(CONFIG_2) U7.76(GND15) U7.77(GND16) U7.78 U9.2(GND)
SIM1_PWR: J15.C1(VCC) R104.1 R105.1 U7.36(SIM1_PWR)
VCC12V: C45.1 C46.1 R111.1 U9.5(VIN)
4G_DISABLE: U7.8(W_DISABLE1#) ; off-sheet 4G_DISABLE
4G_PWREN_H: U7.6(FULL_CARD_PWR_OFF#) ; off-sheet 4G_PWREN_H
4G_RESET: U7.67(RESET#) ; off-sheet 4G_RESET
4G_WAKE_ON_HOST: U7.23(WoWWAN#) ; off-sheet 4G_WAKE_ON_HOST
PCIE20-CLKREQN: R99.1 ; off-sheet PCIE20-CLKREQN
PCIE20-PERSTN: R103.1 ; off-sheet PCIE20-PERSTN
PCIE20-WAKEN: R101.1 ; off-sheet PCIE20-WAKEN
PCIE20_REFCLKN: U7.53(REFCLKN) ; off-sheet PCIE20_REFCLKN
PCIE20_REFCLKP: U7.55(REFCLKP) ; off-sheet PCIE20_REFCLKP
PCIE20_RXN_1: U7.41(PERn0/SATA-B+) ; off-sheet PCIE20_RXN_1
PCIE20_RXP_1: U7.43(PERp0/SATA-B-) ; off-sheet PCIE20_RXP_1
PCIE20_TXN_1: C27.1 ; off-sheet PCIE20_TXN_1
PCIE20_TXP_1: C29.1 ; off-sheet PCIE20_TXP_1
PCIE30X1_CLKREQn_3V3_L: R99.2 U7.52(CLKREQ#)
PCIE30X1_PERSTn_3V3_L: R103.2 U7.50(PERST#)
PCIE30X1_WAKEn_3V3_L: R101.2 U7.54(PEWAKE#)
PCIE_PWREN_H: R113.1 ; off-sheet PCIE_PWREN_H
SIM1_CLK: ED3.1 J15.C3(CLK) U7.32(SIM1_CLK) ; off-sheet SIM1_CLK
SIM1_DATA: ED2.1 J15.C7(I/O) R104.2 U7.34(SIM1_DATA) ; off-sheet SIM1_DATA
SIM1_DET: ED1.1 J15.C9(CD) R105.2 U7.66(SIM1_DET) ; off-sheet SIM1_DET
SIM1_RESET: ED5.1 J15.C2(RST) U7.30(SIM1_RESET) ; off-sheet SIM1_RESET
USB3_HOST1_DM: U7.9(USB_D-) ; off-sheet USB3_HOST1_DM
USB3_HOST1_DP: U7.7(USB_D+) ; off-sheet USB3_HOST1_DP
USB3_HOST1_SSRXN: U7.35(U3_RX-) ; off-sheet USB3_HOST1_SSRXN
USB3_HOST1_SSRXP: U7.37(U3_RX+) ; off-sheet USB3_HOST1_SSRXP
USB3_HOST1_SSTXN: U7.29(U3_TX-) ; off-sheet USB3_HOST1_SSTXN
USB3_HOST1_SSTXP: U7.31(U3_TX+) ; off-sheet USB3_HOST1_SSTXP
W_DISABLE: U7.26(W_DISABLE2#) ; off-sheet W_DISABLE
NetC27_2: C27.2 U7.47(PETn0/SATA-A-)
NetC29_2: C29.2 U7.49(PETp0/SATA-A+)
NetC43_1: C43.1 U9.1(BS)
NetC43_2: C43.2 L2.1 U9.6(LX)
NetC47_2: C47.2 R112.2 R115.1 U9.3(FB/OUT)
NetC51_1: C51.1 R111.2 R113.2 R114.1 U9.4(EN)
NetED4_1: ED4.1 J15.C6(VPP)

Not connected (* = marked no-connect by the designer): U7 1(CONFIG_3) 10(LED1#) 20(I2S_CLK) 22(I2S_TXD) 24(I2S_RXD) 25(DPR) 28(I2S_WA) 38(I2C_SCL) 40(SIM2_DET) 42(SIM2_DATA) 44(SIM2_CLK) 46(SIM2_RESET) 48(SIM2_PWR) 56(RFFE_SCLK) 58(RFFE_SDATA) 59(ANTCTL0) 60(I2S_MCLK) 61(ANTCTL1) 62(COEX2) 63(LAA_TX_EN) 64(COEX1) 65(WL_TX_EN) 68(I2C_SDA)

### Notes on the sheet
- KEY B
- Default 3.39V
- FB=0.6V
- (in symbol M_6.2 NGFF EKEY SOCKET) PCIE M.2 NGFF / E-KEY SOCKET
- (in symbol radxa_1010) Size; Title:; REV; Page Name:; Date:; Sheet; of

### Library data of the parts
C27 = CAP NP_0: cap,100.00nF,+/-10%,10V,X5R,C0201; Manufacturer PN: C0603X5R1A104K030BC; Manufacturer: TDK; Tolerance: 10%; Priority: A; Dielectric: X5R; Created by: JJJ; Part Type: C0201; RK PN: C0603X5R1A104K030BC
C29 = CAP NP_0: cap,100.00nF,+/-10%,10V,X5R,C0201; Manufacturer: TDK; RK PN: C0603X5R1A104K030BC; Priority: A; Tolerance: 10%; Dielectric: X5R; Part Type: C0201; Manufacturer PN: C0603X5R1A104K030BC; Created by: JJJ
C43 = CAP NP_0: cap,100.00nF,+/-10%,25V,X5R,C0402; Manufacturer: TDK; Number: 37; RK PN: C1005X5R1E104K050BC; Priority: A; Tolerance: 10%; C_Voltage: 6.3V; Dielectric: X5R; Part Type: C0402; Manufacturer PN: C1005X5R1E104K050BC; Created by: JJJ
C45 = CAP NP_0: cap,10.00uF,+/-10%,25V,X5R,C1206; Manufacturer: TDK; RK PN: C3216X5R1E106K085AC; Priority: A; C_Voltage: 6.3V; Tolerance: 10%; Dielectric: X5R; Part Type: C1206; Manufacturer PN: C3216X5R1E106K085AC; Created by: JJJ
C46 = CAP NP_0: cap,100.00nF,+/-10%,25V,X5R,C0402; Manufacturer: TDK; RK PN: C1005X5R1E104K050BC; Priority: A; Tolerance: 10%; Dielectric: X5R; Part Type: C0402; Manufacturer PN: C1005X5R1E104K050BC; Created by: JJJ
C47 = CAP NP_0: cap,22.00pF,+/-5%,50V,C0G,C0402; Manufacturer: TDK; RK PN: C1005C0G1H220J050BA; Priority: A; Tolerance: 5%; Dielectric: C0G; Part Type: C0402; Manufacturer PN: C1005C0G1H220J050BA; Created by: JJJ
C48 C49 = CAP NP_0: cap,22.00uF,+/-10%,10V,X5R,C0805; Manufacturer PN: C2012X5R1A226K125AB; Manufacturer: TDK; Tolerance: 10%; Priority: A; Dielectric: X5R; Created by: JJJ; C_Voltage: 6.3V; Part Type: C0805; RK PN: C2012X5R1A226K125AB
C50 = CAP NP_0: cap,100.00nF,+/-10%,10V,X5R,C0402; Manufacturer PN: C1005X5R1A104K050BA; Manufacturer: TDK; C_Voltage: 6.3V; Tolerance: 10%; Priority: A; Number: 37; Dielectric: X5R; Created by: JJJ; Part Type: C0402; RK PN: C1005X5R1A104K050BA
C51 = CAP NP_0: as C9 on sheet 04; Dielectric: X5R; Part Type: C0402; Manufacturer PN: C1005X5R1A104K050BA; Created by: JJJ
ED1-ED5 = DIODE BI_DIR TRIG_0: 1-Line, Bi-directional, Transient Voltage Suppressors.17.5pF.; Manufacturer PN: ESD5451N; Manufacturer: WillSemi(韦尔半导体); Priority: A; Created by: JJJ; Part Type: ESD_TVS; RK PN: ESD5451N
J15 = SIM-SPPN08-X0-1X80_0: SIM Card Connector,9pin,SMT
L2 = INDUCTORS OF FERRITE_Dup1: Power Inductor,4.7uH,0.2,IND_606045; Manufacturer PN: SWPA6045S4R7MT; Manufacturer: sunlord; DC Resistor: 0.02ohm; Isat: 4.97A; Resonace frequency: 24M; Irms: 3.3A; Tolerance: 20%; Priority: A; Created by: YWQ; Part Type: POWER_IND; RK PN: SWPA6045S4R7MT
P22 = TESTPOINT1
R99 R103 = RESISTOR_0_Dup1: as R3 on sheet 04; Part Type: 通用厚膜电阻; Manufacturer PN: RC0402JR-0722RL; Created by: YTL
R101 = RESISTOR_0_Dup1: as R1 on sheet 04; Created by: YTL; Part Type: 通用厚膜电阻; RK PN: RC0402JR-0722RL
R104 R105 = RESISTOR_0_Dup1: as R33 on sheet 04; Part Type: 通用厚膜电阻; Manufacturer PN: RC0402JR-074K7L; Created by: YTL
R111 = RESISTOR_0_Dup1: 通用厚膜电阻,24K,+/-5%,R0402,1/16W.; Manufacturer PN: RC0402JR-0724KL; Manufacturer: YAGEO; Tolerance: 5%; Wattage: 1/16W; Priority: A; Created by: YTL; Part Type: 通用厚膜电阻; RK PN: RC0402JR-0724KL
R112 = RESISTOR_0_Dup1: 通用厚膜电阻,232K,+/-1%,R0402,1/16W.; Manufacturer PN: RC0402FR-07232KL; Manufacturer: YAGEO; Wattage: 1/16W; Priority: A; Created by: YTL; Part Type: 通用厚膜电阻; RK PN: RC0402FR-07232KL
R113 = RESISTOR_0_Dup1: 通用厚膜电阻,100K,+/-5%,R0402,1/16W.; Manufacturer PN: RC0402JR-07100KL; Manufacturer: YAGEO; Tolerance: 5%; Wattage: 1/16W; Priority: A; Created by: YTL; Part Type: 通用厚膜电阻; RK PN: RC0402JR-07100KL
R114 = RESISTOR_0_Dup1: 通用厚膜电阻,24K,+/-5%,R0402,1/16W.; Manufacturer: YAGEO; Tolerance: 5%; RK PN: RC0402JR-0724KL; Priority: A; Wattage: 1/16W; Part Type: 通用厚膜电阻; Manufacturer PN: RC0402JR-0724KL; Created by: YTL
R115 = RESISTOR_0_Dup1: 通用厚膜电阻,49K9,+/-1%,R0402,1/16W.; Manufacturer: YAGEO; RK PN: RC0402FR-0749K9L; Priority: A; Wattage: 1/16W; Part Type: 通用厚膜电阻; Manufacturer PN: RC0402FR-0749K9L; Created by: YTL
U7 = M_6.2 NGFF EKEY SOCKET
U9 = DCDC_SY8113: Manufacturer: Silergy（矽力杰）; Priority: A; Created by: JJJ; Manufacturer PN: SY8113B; Part Type: DCDC; RK PN: SY8113B
*#4 = radxa_1010: Page Create Date: March  8, 1995

## Sheet 06.SchDoc
size 297 x 209 mm
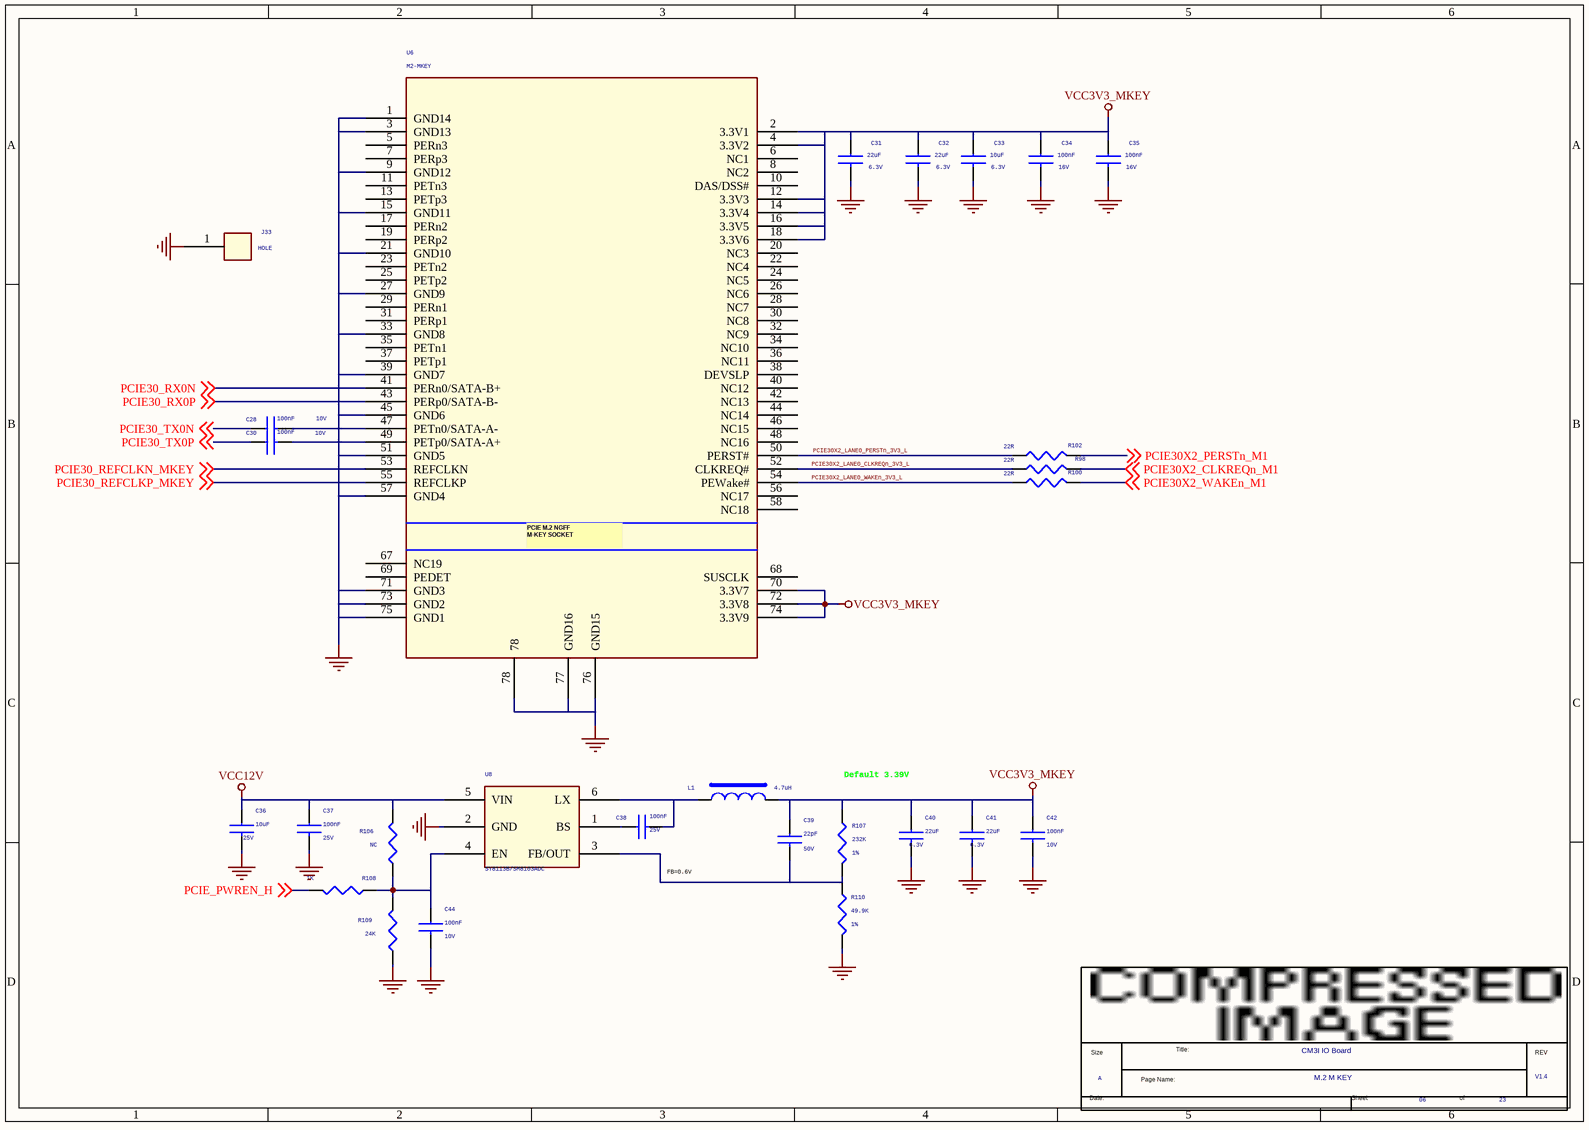
[diagram p4: 06.SchDoc]

### Parts
(Parts that share a designator on the sheet are numbered #1, #2 ... from top to bottom, then left to right.)
*#5  Page Count: 23  Page Number: 06  Page Size: A  Title: CM3I IO Board  RevCode: V1.4  Doc: M.2 M KEY  (hidden comment: radxa_1010)  (graphical)
C28  100nF  Voltage: 10V  [C0402]
C30  100nF  Voltage: 10V  [C0402]
C31  22uF  Voltage: 6.3V  [C0603]
C32  22uF  Voltage: 6.3V  [C0603]
C33  10uF  Voltage: 6.3V  [C0603]
C34  100nF  Voltage: 16V  [C0402]
C35  100nF  Voltage: 16V  [C0402]
C36  10uF  Voltage: 25V  [C1206]
C37  100nF  Voltage: 25V  [C0402]
C38  100nF  Voltage: 25V  [C0402]
C39  22pF  Voltage: 50V  [C0402]
C40  22uF  Voltage: 6.3V  [C0603]
C41  22uF  Voltage: 6.3V  [C0603]
C42  100nF  Voltage: 10V  [C0402]
C44  100nF  Voltage: 10V  [C0402]
J33  HOLE  [HOLE_5D5X2D7MM]
L1  4.7uH  [IND-4X4]
R98  22R  [R0402]
R100  22R  [R0402]
R102  22R  [R0402]
R106  NC  [R0402]
R107  232K  Tolerance: 1%  [R0402]
R108  1K  [R0402]
R109  24K  [R0402]
R110  49.9K  Tolerance: 1%  [R0402]
U6  M2-MKEY  [M2_NGFF_KEY_M_1]
U8  SY8113B/SM8103ADC  [SOT_23_6]

### Nets
GND: C31.2 C32.2 C33.2 C34.2 C35.2 C36.2 C37.2 C40.2 C41.2 C42.2 C44.2 J33.1 R109.2 R110.2 U6.1(GND14) U6.3(GND13) U6.9(GND12) U6.15(GND11) U6.21(GND10) U6.27(GND9) U6.33(GND8) U6.39(GND7) U6.45(GND6) U6.51(GND5) U6.57(GND4) U6.71(GND3) U6.73(GND2) U6.75(GND1) U6.76(GND15) U6.77(GND16) U6.78 U8.2(GND)
VCC3V3_MKEY: C31.1 C32.1 C33.1 C34.1 C35.1 C39.1 C40.1 C41.1 C42.1 L1.2 R107.1 U6.2(3.3V1) U6.4(3.3V2) U6.12(3.3V3) U6.14(3.3V4) U6.16(3.3V5) U6.18(3.3V6) U6.70(3.3V7) U6.72(3.3V8) U6.74(3.3V9)
VCC12V: C36.1 C37.1 R106.1 U8.5(VIN)
PCIE30_REFCLKN_MKEY: U6.53(REFCLKN) ; off-sheet PCIE30_REFCLKN_MKEY
PCIE30_REFCLKP_MKEY: U6.55(REFCLKP) ; off-sheet PCIE30_REFCLKP_MKEY
PCIE30_RX0N: U6.41(PERn0/SATA-B+) ; off-sheet PCIE30_RX0N
PCIE30_RX0P: U6.43(PERp0/SATA-B-) ; off-sheet PCIE30_RX0P
PCIE30_TX0N: C28.1 ; off-sheet PCIE30_TX0N
PCIE30_TX0P: C30.1 ; off-sheet PCIE30_TX0P
PCIE30X2_CLKREQn_M1: R98.1 ; off-sheet PCIE30X2_CLKREQn_M1
PCIE30X2_LANE0_CLKREQn_3V3_L: R98.2 U6.52(CLKREQ#)
PCIE30X2_LANE0_PERSTn_3V3_L: R102.2 U6.50(PERST#)
PCIE30X2_LANE0_WAKEn_3V3_L: R100.2 U6.54(PEWake#)
PCIE30X2_PERSTn_M1: R102.1 ; off-sheet PCIE30X2_PERSTn_M1
PCIE30X2_WAKEn_M1: R100.1 ; off-sheet PCIE30X2_WAKEn_M1
PCIE_PWREN_H: R108.1 ; off-sheet PCIE_PWREN_H
NetC28_2: C28.2 U6.47(PETn0/SATA-A-)
NetC30_2: C30.2 U6.49(PETp0/SATA-A+)
NetC38_1: C38.1 U8.1(BS)
NetC38_2: C38.2 L1.1 U8.6(LX)
NetC39_2: C39.2 R107.2 R110.1 U8.3(FB/OUT)
NetC44_1: C44.1 R106.2 R108.2 R109.1 U8.4(EN)

Not connected (* = marked no-connect by the designer): U6 5(PERn3) 6(NC1) 7(PERp3) 8(NC2) 10(DAS/DSS#) 11(PETn3) 13(PETp3) 17(PERn2) 19(PERp2) 20(NC3) 22(NC4) 23(PETn2) 24(NC5) 25(PETp2) 26(NC6) 28(NC7) 29(PERn1) 30(NC8) 31(PERp1) 32(NC9) 34(NC10) 35(PETn1) 36(NC11) 37(PETp1) 38(DEVSLP) 40(NC12) 42(NC13) 44(NC14) 46(NC15) 48(NC16) 56(NC17) 58(NC18) 67(NC19) 68(SUSCLK) 69(PEDET)

### Notes on the sheet
- Default 3.39V
- FB=0.6V
- (in symbol M_5.2 NGFF EKEY SOCKET) PCIE M.2 NGFF / M-KEY SOCKET
- (in symbol radxa_1010) Title:; Size; REV; Page Name:; Date:; Sheet; of

### Library data of the parts
C28 = CAP NP_0: as C29 on sheet 05; Dielectric: X5R; Part Type: C0201; Manufacturer PN: C0603X5R1A104K030BC; Created by: JJJ
C30 = CAP NP_0: as C27 on sheet 05; Dielectric: X5R; Created by: JJJ; Part Type: C0201; RK PN: C0603X5R1A104K030BC
C31 = CAP NP_0: cap,22.00uF,+/-20%,6.3V,X5R,C0603; Manufacturer PN: C1608X5R0J226M080AC; Manufacturer: TDK; Tolerance: 20%; Priority: A; Dielectric: X5R; Created by: JJJ; Part Type: C0603; RK PN: C1608X5R0J226M080AC
C32 = CAP NP_0: cap,22.00uF,+/-20%,6.3V,X5R,C0603; Manufacturer: TDK; RK PN: C1608X5R0J226M080AC; Priority: A; Tolerance: 20%; Dielectric: X5R; Part Type: C0603; Manufacturer PN: C1608X5R0J226M080AC; Created by: JJJ
C33 = CAP NP_0: cap,10.00uF,+/-10%,6.3V,X5R,C0603; Manufacturer: TDK; RK PN: C1608X5R0J106K080AB; Priority: A; Tolerance: 10%; Dielectric: X5R; Part Type: C0603; Manufacturer PN: C1608X5R0J106K080AB; Created by: JJJ
C34 = CAP NP_0: as C1 on sheet 04; Dielectric: X5R; Part Type: C0402; Manufacturer PN: C1005X5R1C104K050BA; Created by: JJJ
C35 = CAP NP_0: as C4 on sheet 04; Dielectric: X5R; Created by: JJJ; Part Type: C0402; RK PN: C1005X5R1C104K050BA
C36 = CAP NP_0: cap,10.00uF,+/-10%,25V,X5R,C1206; Manufacturer PN: C3216X5R1E106K085AC; Manufacturer: TDK; Tolerance: 10%; C_Voltage: 6.3V; Priority: A; Dielectric: X5R; Created by: JJJ; Part Type: C1206; RK PN: C3216X5R1E106K085AC
C37 = CAP NP_0: as C46 on sheet 05; Dielectric: X5R; Part Type: C0402; Manufacturer PN: C1005X5R1E104K050BC; Created by: JJJ
C38 = CAP NP_0: cap,100.00nF,+/-10%,25V,X5R,C0402; Manufacturer PN: C1005X5R1E104K050BC; Manufacturer: TDK; C_Voltage: 6.3V; Tolerance: 10%; Priority: A; Number: 37; Dielectric: X5R; Created by: JJJ; Part Type: C0402; RK PN: C1005X5R1E104K050BC
C39 = CAP NP_0: cap,22.00pF,+/-5%,50V,C0G,C0402; Manufacturer: TDK; Manufacturer PN: C1005C0G1H220J050BA; Tolerance: 5%; Priority: A; Dielectric: C0G; Created by: JJJ; Part Type: C0402; RK PN: C1005C0G1H220J050BA
C40 = CAP NP_0: cap,22.00uF,+/-10%,10V,X5R,C0805; Manufacturer: TDK; RK PN: C2012X5R1A226K125AB; Priority: A; Tolerance: 10%; Dielectric: X5R; Part Type: C0805; C_Voltage: 6.3V; Manufacturer PN: C2012X5R1A226K125AB; Created by: JJJ
C41 = CAP NP_0: as C48 on sheet 05; Dielectric: X5R; Created by: JJJ; C_Voltage: 6.3V; Part Type: C0805; RK PN: C2012X5R1A226K125AB
C42 C44 = CAP NP_0: as C50 on sheet 05; Dielectric: X5R; Created by: JJJ; Part Type: C0402; RK PN: C1005X5R1A104K050BA
J33 = CON1
L1 = INDUCTORS OF FERRITE_Dup1: Power Inductor,4.7uH,0.2,IND_606045; Manufacturer: sunlord; DC Resistor: 0.02ohm; Isat: 4.97A; RK PN: SWPA6045S4R7MT; Priority: A; Tolerance: 20%; Irms: 3.3A; Resonace frequency: 24M; Part Type: POWER_IND; Manufacturer PN: SWPA6045S4R7MT; Created by: YWQ
R98 = RESISTOR_0_Dup1: as R3 on sheet 04; Part Type: 通用厚膜电阻; Manufacturer PN: RC0402JR-0722RL; Created by: YTL
R100 R102 = RESISTOR_0_Dup1: as R1 on sheet 04; Created by: YTL; Part Type: 通用厚膜电阻; RK PN: RC0402JR-0722RL
R106 R109 = RESISTOR_0_Dup1: as R111 on sheet 05; Created by: YTL; Part Type: 通用厚膜电阻; RK PN: RC0402JR-0724KL
R107 = RESISTOR_0_Dup1: as R112 on sheet 05; Created by: YTL; Part Type: 通用厚膜电阻; RK PN: RC0402FR-07232KL
R108 = RESISTOR_0_Dup1: 通用厚膜电阻,100K,+/-5%,R0402,1/16W.; Manufacturer: YAGEO; Tolerance: 5%; RK PN: RC0402JR-07100KL; Priority: A; Wattage: 1/16W; Part Type: 通用厚膜电阻; Manufacturer PN: RC0402JR-07100KL; Created by: YTL
R110 = RESISTOR_0_Dup1: 通用厚膜电阻,49K9,+/-1%,R0402,1/16W.; Manufacturer PN: RC0402FR-0749K9L; Manufacturer: YAGEO; Wattage: 1/16W; Priority: A; Created by: YTL; Part Type: 通用厚膜电阻; RK PN: RC0402FR-0749K9L
U6 = M_5.2 NGFF EKEY SOCKET
U8 = DCDC_SY8113: Manufacturer: Silergy（矽力杰）; Priority: A; RK PN: SY8113B; Part Type: DCDC; Manufacturer PN: SY8113B; Created by: JJJ
*#5 = radxa_1010: Page Create Date: March  8, 1995

## Sheet 07.SchDoc
size 297 x 209 mm
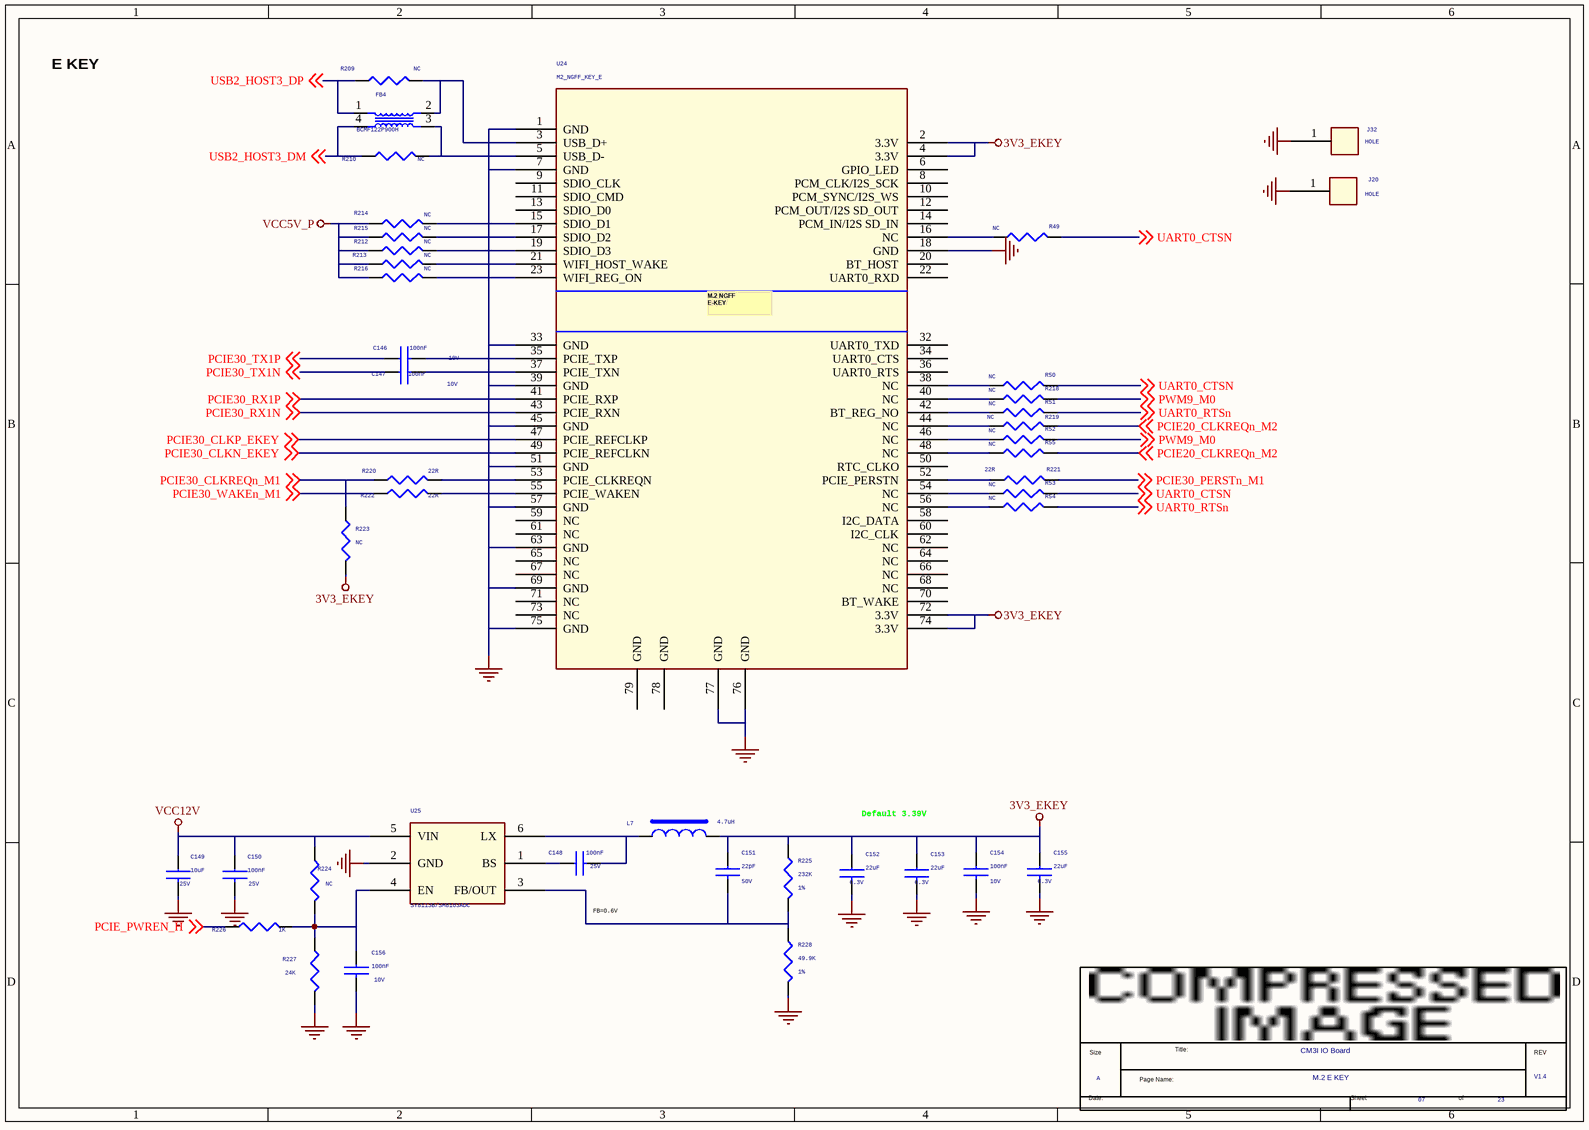
[diagram p5: 07.SchDoc]

### Parts
(Parts that share a designator on the sheet are numbered #1, #2 ... from top to bottom, then left to right.)
*#6  Page Count: 23  Page Number: 07  Page Size: A  Title: CM3I IO Board  RevCode: V1.4  Doc: M.2 E KEY  (hidden comment: radxa_1010)  (graphical)
C146  100nF  Voltage: 10V  [C0402]
C147  100nF  Voltage: 10V  [C0402]
C148  100nF  Voltage: 25V  [C0402]
C149  10uF  Voltage: 25V  [C0805]
C150  100nF  Voltage: 25V  [C0402]
C151  22pF  Voltage: 50V  [C0402]
C152  22uF  Voltage: 6.3V  [C0603]
C153  22uF  Voltage: 6.3V  [C0603]
C154  100nF  Voltage: 10V  [C0402]
C155  22uF  Voltage: 6.3V  [C0603]
C156  100nF  Voltage: 10V  [C0402]
FB4  BCMF122P900H  [GMDG-4PIN_ESD]
J20  HOLE  [HOLE_5D5X2D7MM]
J32  HOLE  [HOLE_5D5X2D7MM]
L7  4.7uH  [IND-4X4]
R49  NC  [R0402]
R50  NC  [R0402]
R51  NC  [R0402]
R52  NC  [R0402]
R53  NC  [R0402]
R54  NC  [R0402]
R55  NC  [R0402]
R209  NC  [R0402]
R210  NC  [R0402]
R212  NC  [R0402]
R213  NC  [R0402]
R214  NC  [R0402]
R215  NC  [R0402]
R216  NC  [R0402]
R218  NC  [R0402]
R219  NC  [R0402]
R220  22R  [R0402]
R221  22R  [R0402]
R222  22R  [R0402]
R223  NC  [R0402]
R224  NC  [R0402]
R225  232K  Tolerance: 1%  [R0402]
R226  1K  [R0402]
R227  24K  [R0402]
R228  49.9K  Tolerance: 1%  [R0402]
U24  M2_NGFF_KEY_E  [M2_NGFF_KEY_E_42X30]
U25  SY8113B/SM8103ADC  [SOT_23_6]

### Nets
3V3_EKEY: C151.1 C152.1 C153.1 C154.1 C155.1 L7.2 R223.2 R225.1 U24.2(3.3V) U24.4(3.3V) U24.72(3.3V) U24.74(3.3V)
GND: C149.2 C150.2 C152.2 C153.2 C154.2 C155.2 C156.2 J20.1 J32.1 R227.2 R228.2 U24.1(GND) U24.7(GND) U24.18(GND) U24.33(GND) U24.39(GND) U24.45(GND) U24.51(GND) U24.57(GND) U24.63(GND) U24.69(GND) U24.75(GND) U24.76(GND) U24.77(GND) U25.2(GND)
VCC5V_P: R212.1 R213.1 R214.1 R215.1 R216.1
VCC12V: C149.1 C150.1 R224.1 U25.5(VIN)
PCIE20_CLKREQn_M2: R55.1 R219.1 ; off-sheet PCIE20_CLKREQn_M2
PCIE30_CLKN_EKEY: U24.49(PCIE_REFCLKN) ; off-sheet PCIE30_CLKN_EKEY
PCIE30_CLKP_EKEY: U24.47(PCIE_REFCLKP) ; off-sheet PCIE30_CLKP_EKEY
PCIE30_CLKREQn_M1: R220.1 R223.1 ; off-sheet PCIE30_CLKREQn_M1
PCIE30_PERSTn_M1: R221.1 ; off-sheet PCIE30_PERSTn_M1
PCIE30_RX1N: U24.43(PCIE_RXN) ; off-sheet PCIE30_RX1N
PCIE30_RX1P: U24.41(PCIE_RXP) ; off-sheet PCIE30_RX1P
PCIE30_TX1N: C147.1 ; off-sheet PCIE30_TX1N
PCIE30_TX1P: C146.1 ; off-sheet PCIE30_TX1P
PCIE30_WAKEn_M1: R222.1 ; off-sheet PCIE30_WAKEn_M1
PCIE_PWREN_H: R226.1 ; off-sheet PCIE_PWREN_H
PWM9_M0: R52.1 R218.1 ; off-sheet PWM9_M0
UART0_CTSN: R49.1 R50.1 R53.1 ; off-sheet UART0_CTSN
UART0_RTSn: R51.1 R54.1 ; off-sheet UART0_RTSn
USB2_HOST3_DM: FB4.4(R2) R210.1 ; off-sheet USB2_HOST3_DM
USB2_HOST3_DP: FB4.1(R1) R209.1 ; off-sheet USB2_HOST3_DP
NetC146_2: C146.2 U24.35(PCIE_TXP)
NetC147_2: C147.2 U24.37(PCIE_TXN)
NetC148_1: C148.1 U25.1(BS)
NetC148_2: C148.2 L7.1 U25.6(LX)
NetC151_2: C151.2 R225.2 R228.1 U25.3(FB/OUT)
NetC156_1: C156.1 R224.2 R226.2 R227.1 U25.4(EN)
NetFB4_2: FB4.2(R4) R209.2 U24.3(USB_D+)
NetFB4_3: FB4.3(R3) R210.2 U24.5(USB_D-)
NetR49_2: R49.2 U24.16(NC)
NetR50_2: R50.2 U24.38(NC)
NetR51_2: R51.2 U24.42(BT_REG_NO)
NetR52_2: R52.2 U24.46(NC)
NetR53_2: R53.2 U24.54(NC)
NetR54_2: R54.2 U24.56(NC)
NetR55_2: R55.2 U24.48(NC)
NetR212_2: R212.2 U24.19(SDIO_D3)
NetR213_2: R213.2 U24.21(WIFI_HOST_WAKE)
NetR214_2: R214.2 U24.15(SDIO_D1)
NetR215_2: R215.2 U24.17(SDIO_D2)
NetR216_2: R216.2 U24.23(WIFI_REG_ON)
NetR218_2: R218.2 U24.40(NC)
NetR219_2: R219.2 U24.44(NC)
NetR220_2: R220.2 U24.53(PCIE_CLKREQN)
NetR221_2: R221.2 U24.52(PCIE_PERSTN)
NetR222_2: R222.2 U24.55(PCIE_WAKEN)

Not connected (* = marked no-connect by the designer): U24 6(GPIO_LED) 8(PCM_CLK/I2S_SCK) 9(SDIO_CLK) 10(PCM_SYNC/I2S_WS) 11(SDIO_CMD) 12(PCM_OUT/I2S_SD_OUT) 13(SDIO_D0) 14(PCM_IN/I2S_SD_IN) 20(BT_HOST) 22(UART0_RXD) 32(UART0_TXD) 34(UART0_CTS) 36(UART0_RTS) 50(RTC_CLKO) 58(I2C_DATA) 59(NC) 60(I2C_CLK) 61(NC) 62(NC) 64(NC) 65(NC) 66(NC) 67(NC) 68(NC) 70(BT_WAKE) 71(NC) 73(NC) 78(GND) 79(GND)

### Notes on the sheet
- E KEY
- Default 3.39V
- (near C148) FB=0.6V
- (in symbol M_8.2 NGFF EKEY SOCKET) M.2 NGFF / E-KEY
- (in symbol radxa_1010) Title:; Size; REV; Page Name:; Date:; Sheet; of

### Library data of the parts
C146 = CAP NP_0: as C27 on sheet 05; Dielectric: X5R; Created by: JJJ; Part Type: C0201; RK PN: C0603X5R1A104K030BC
C147 = CAP NP_0: as C29 on sheet 05; Dielectric: X5R; Part Type: C0201; Manufacturer PN: C0603X5R1A104K030BC; Created by: JJJ
C148 = CAP NP_0: as C38 on sheet 06; Dielectric: X5R; Created by: JJJ; Part Type: C0402; RK PN: C1005X5R1E104K050BC
C149 = CAP NP_0: as C45 on sheet 05; Dielectric: X5R; Part Type: C1206; Manufacturer PN: C3216X5R1E106K085AC; Created by: JJJ
C150 = CAP NP_0: cap,100.00nF,+/-10%,25V,X5R,C0402; Manufacturer PN: C1005X5R1E104K050BC; Manufacturer: TDK; Tolerance: 10%; Priority: A; Dielectric: X5R; Created by: JJJ; Part Type: C0402; RK PN: C1005X5R1E104K050BC
C151 = CAP NP_0: as C47 on sheet 05; Dielectric: C0G; Part Type: C0402; Manufacturer PN: C1005C0G1H220J050BA; Created by: JJJ
C152 C155 = CAP NP_0: as C40 on sheet 06; Dielectric: X5R; Part Type: C0805; C_Voltage: 6.3V; Manufacturer PN: C2012X5R1A226K125AB; Created by: JJJ
C153 = CAP NP_0: as C48 on sheet 05; Dielectric: X5R; Created by: JJJ; C_Voltage: 6.3V; Part Type: C0805; RK PN: C2012X5R1A226K125AB
C154 C156 = CAP NP_0: as C9 on sheet 04; Dielectric: X5R; Part Type: C0402; Manufacturer PN: C1005X5R1A104K050BA; Created by: JJJ
FB4 = R-PACK4_1_Dup1
J20 J32 = CON1
L7 = INDUCTORS OF FERRITE_Dup1: as L1 on sheet 06; Part Type: POWER_IND; Manufacturer PN: SWPA6045S4R7MT; Created by: YWQ
R49 R212 R215 R216 R219 R221 = RESISTOR_0_Dup1: as R3 on sheet 04; Part Type: 通用厚膜电阻; Manufacturer PN: RC0402JR-0722RL; Created by: YTL
R50-R55 R209 R210 R213 R214 R218 R220 R222 = RESISTOR_0_Dup1: as R1 on sheet 04; Created by: YTL; Part Type: 通用厚膜电阻; RK PN: RC0402JR-0722RL
R223 = RESISTOR_0_Dup1: as R8 on sheet 04; Created by: YTL; Part Type: 通用厚膜电阻; RK PN: RC0402JR-0710KL
R224 R227 = RESISTOR_0_Dup1: as R111 on sheet 05; Created by: YTL; Part Type: 通用厚膜电阻; RK PN: RC0402JR-0724KL
R225 = RESISTOR_0_Dup1: 通用厚膜电阻,232K,+/-1%,R0402,1/16W.; Manufacturer: YAGEO; RK PN: RC0402FR-07232KL; Priority: A; Wattage: 1/16W; Part Type: 通用厚膜电阻; Manufacturer PN: RC0402FR-07232KL; Created by: YTL
R226 = RESISTOR_0_Dup1: as R113 on sheet 05; Created by: YTL; Part Type: 通用厚膜电阻; RK PN: RC0402JR-07100KL
R228 = RESISTOR_0_Dup1: as R110 on sheet 06; Created by: YTL; Part Type: 通用厚膜电阻; RK PN: RC0402FR-0749K9L
U24 = M_8.2 NGFF EKEY SOCKET
U25 = DCDC_SY8113: Manufacturer: Silergy（矽力杰）; Priority: A; Created by: JJJ; Manufacturer PN: SY8113B; Part Type: DCDC; RK PN: SY8113B
*#6 = radxa_1010: Page Create Date: March  8, 1995

## Sheet 08.SchDoc
size 420 x 297 mm
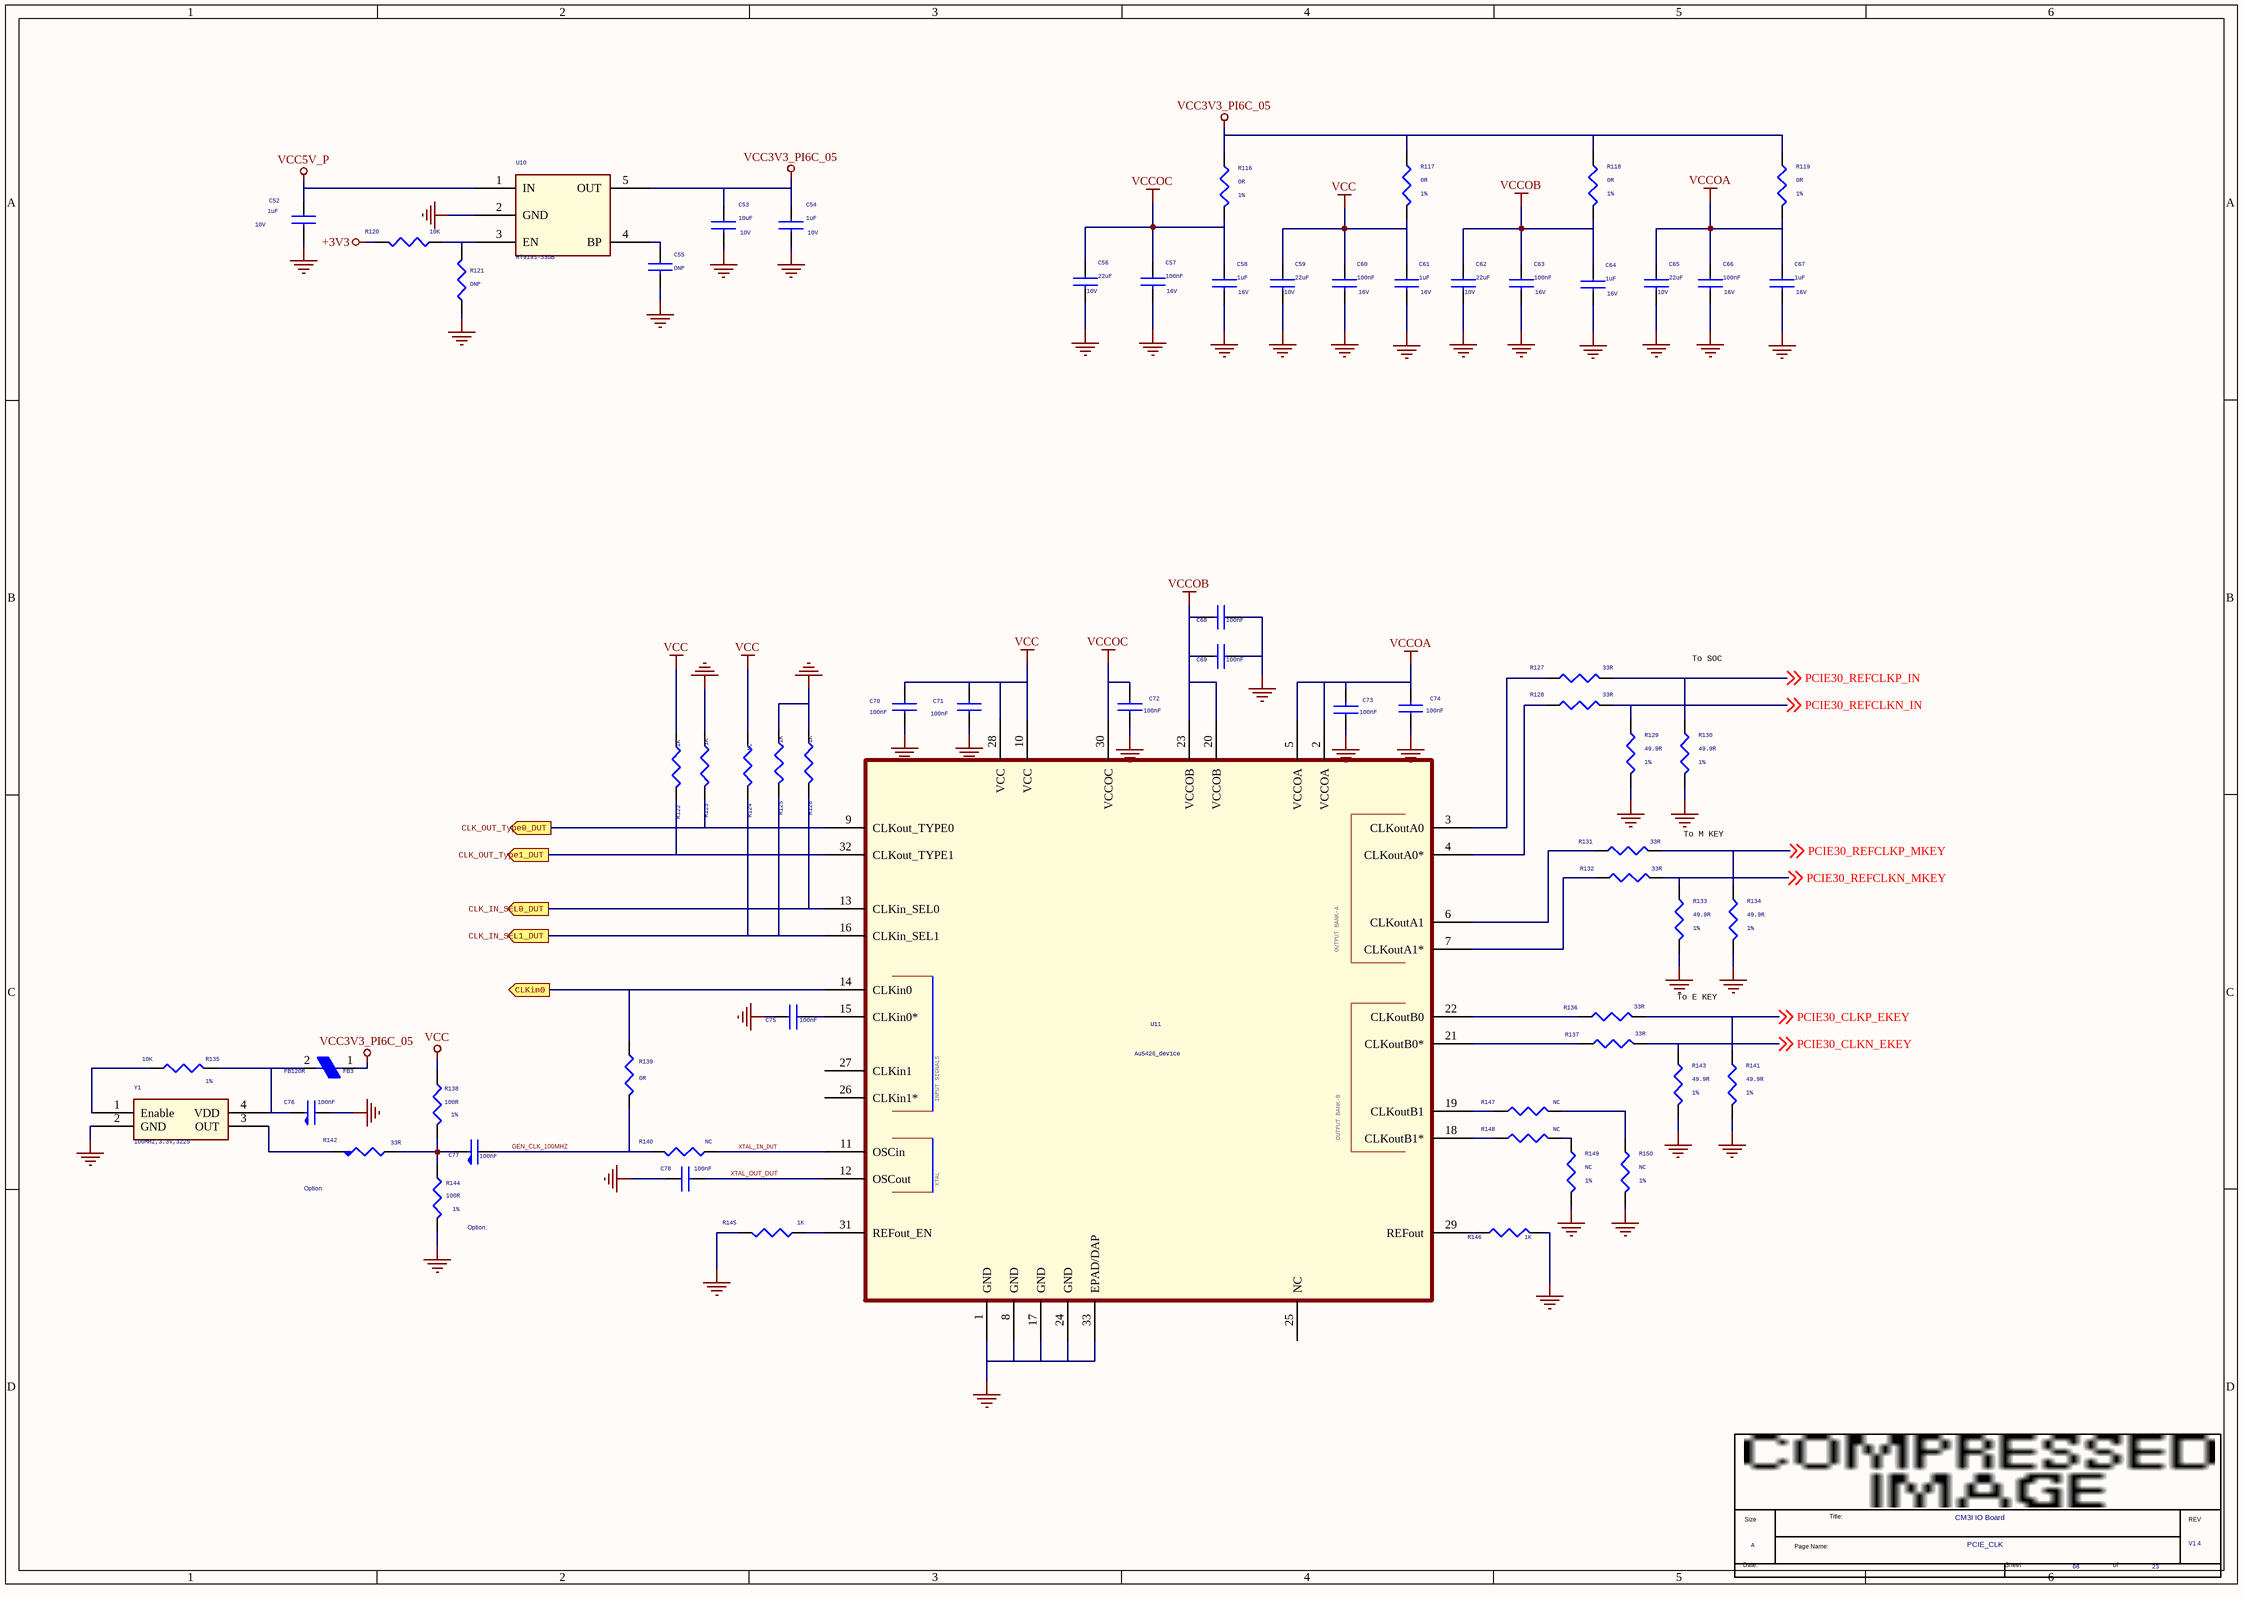
[diagram p6: 08.SchDoc]

### Parts
(Parts that share a designator on the sheet are numbered #1, #2 ... from top to bottom, then left to right.)
*#7  Page Count: 23  Page Number: 08  Page Size: A  Title: CM3I IO Board  RevCode: V1.4  Doc: PCIE_CLK  (hidden comment: radxa_1010)  (graphical)
C52  1uF  Voltage: 10V  [C0402]
C53  10uF  Voltage: 10V  [C0603]
C54  1uF  Voltage: 10V  [C0402]
C55  DNP  [C0402]
C56  22uF  Voltage: 10V  [C0603]
C57  100nF  Voltage: 16V  [C0402]
C58  1uF  Voltage: 16V  [C0402]
C59  22uF  Voltage: 10V  [C0603]
C60  100nF  Voltage: 16V  [C0402]
C61  1uF  Voltage: 16V  [C0402]
C62  22uF  Voltage: 10V  [C0603]
C63  100nF  Voltage: 16V  [C0402]
C64  1uF  Voltage: 16V  [C0402]
C65  22uF  Voltage: 10V  [C0603]
C66  100nF  Voltage: 16V  [C0402]
C67  1uF  Voltage: 16V  [C0402]
C68  100nF  [C0402]
C69  100nF  [C0402]
C70  100nF  [C0402]
C71  100nF  [C0402]
C72  100nF  [C0402]
C73  100nF  [C0402]
C74  100nF  [C0402]
C75  100nF  [C0402]
C76  100nF  [C0402]
C77  100nF  [C0402]
C78  100nF  [C0402]
FB3  FB120R  [R0402]
R116  0R  Tolerance: 1%  [R0402]
R117  0R  Tolerance: 1%  [R0402]
R118  0R  Tolerance: 1%  [R0402]
R119  0R  Tolerance: 1%  [R0402]
R120  10K  [R0402]
R121  DNP  [R0402]
R122  1K  [R0402]
R123  1K  [R0402]
R124  NC  [R0402]
R125  1K  [R0402]
R126  1K  [R0402]
R127  33R  [R0402]
R128  33R  [R0402]
R129  49.9R  Tolerance: 1%  [R0402]
R130  49.9R  Tolerance: 1%  [R0402]
R131  33R  [R0402]
R132  33R  [R0402]
R133  49.9R  Tolerance: 1%  [R0402]
R134  49.9R  Tolerance: 1%  [R0402]
R135  10K  Tolerance: 1%  [R0402]
R136  33R  [R0402]
R137  33R  [R0402]
R138  100R  Tolerance: 1%  [R0402]
R139  0R  [R0402]
R140  NC  [R0402]
R141  49.9R  Tolerance: 1%  [R0402]
R142  33R  [R0402]
R143  49.9R  Tolerance: 1%  [R0402]
R144  100R  Tolerance: 1%  [R0402]
R145  1K  [R0402]
R146  1K  [R0402]
R147  NC  [R0402]
R148  NC  [R0402]
R149  NC  Tolerance: 1%  [R0402]
R150  NC  Tolerance: 1%  [R0402]
U10  RT9193-33GB  [SOT_23_5]
U11  Au5426_device  [QFN50P500X500X90-33N]
Y1  100MHz,3.3V,3225  [Y-4-5_08-TXC-7W5]

### Ports
CLK_IN_SEL0_DUT (out), CLK_IN_SEL1_DUT (out), CLK_OUT_Type0_DUT (out), CLK_OUT_Type1_DUT (out), CLKin0 (out)

### Nets
+3V3: R120.1
GND: C52.2 C53.2 C54.2 C55.2 C56.2 C57.2 C58.2 C59.2 C60.2 C61.2 C62.2 C63.2 C64.2 C65.2 C66.2 C67.2 C68.1 C69.1 C70.1 C71.1 C72.1 C73.1 C74.1 C75.1 C76.2 C78.1 R121.2 R123.1 R125.1 R126.1 R129.2 R130.2 R133.2 R134.2 R141.2 R143.2 R144.2 R145.2 R146.1 R149.2 R150.2 U10.2(GND) U11.1(GND) U11.8(GND) U11.17(GND) U11.24(GND) U11.33(EPAD/DAP) Y1.2(GND)
VCC: C59.1 C60.1 C61.1 C70.2 C71.2 R117.2 R122.1 R124.1 R138.1 U11.10(VCC) U11.28(VCC)
VCC3V3_PI6C_05: C53.1 C54.1 FB3.1 R116.1 R117.1 R118.1 R119.1 U10.5(OUT)
VCC5V_P: C52.1 U10.1(IN)
VCCOA: C65.1 C66.1 C67.1 C73.2 C74.2 R119.2 U11.2(VCCOA) U11.5(VCCOA)
VCCOB: C62.1 C63.1 C64.1 C68.2 C69.2 R118.2 U11.20(VCCOB) U11.23(VCCOB)
VCCOC: C56.1 C57.1 C58.1 C72.2 R116.2 U11.30(VCCOC)
GEN_CLK_100MHZ: C77.2 R139.2 R140.2
PCIE30_CLKN_EKEY: R137.2 R143.1 ; off-sheet PCIE30_CLKN_EKEY
PCIE30_CLKP_EKEY: R136.2 R141.1 ; off-sheet PCIE30_CLKP_EKEY
PCIE30_REFCLKN_IN: R128.2 R129.1 ; off-sheet PCIE30_REFCLKN_IN
PCIE30_REFCLKN_MKEY: R132.2 R133.1 ; off-sheet PCIE30_REFCLKN_MKEY
PCIE30_REFCLKP_IN: R127.2 R130.1 ; off-sheet PCIE30_REFCLKP_IN
PCIE30_REFCLKP_MKEY: R131.2 R134.1 ; off-sheet PCIE30_REFCLKP_MKEY
XTAL_IN_DUT: R140.1 U11.11(OSCin)
XTAL_OUT_DUT: C78.2 U11.12(OSCout)
NetC55_1: C55.1 U10.4(BP)
NetC75_2: C75.2 U11.15(CLKin0*)
NetC76_1: C76.1 FB3.2 R135.1 Y1.4(VDD)
NetC77_1: C77.1 R138.2 R142.2 R144.1
NetR120_2: R120.2 R121.1 U10.3(EN)
NetR122_2: R122.2 U11.32(CLKout_TYPE1) ; port CLK_OUT_Type1_DUT
NetR123_2: R123.2 U11.9(CLKout_TYPE0) ; port CLK_OUT_Type0_DUT
NetR124_2: R124.2 R125.2 U11.16(CLKin_SEL1) ; port CLK_IN_SEL1_DUT
NetR126_2: R126.2 U11.13(CLKin_SEL0) ; port CLK_IN_SEL0_DUT
NetR127_1: R127.1 U11.3(CLKoutA0)
NetR128_1: R128.1 U11.4(CLKoutA0*)
NetR131_1: R131.1 U11.6(CLKoutA1)
NetR132_1: R132.1 U11.7(CLKoutA1*)
NetR135_2: R135.2 Y1.1(Enable)
NetR136_1: R136.1 U11.22(CLKoutB0)
NetR137_1: R137.1 U11.21(CLKoutB0*)
NetR139_1: R139.1 U11.14(CLKin0) ; port CLKin0
NetR142_1: R142.1 Y1.3(OUT)
NetR145_1: R145.1 U11.31(REFout_EN)
NetR146_2: R146.2 U11.29(REFout)
NetR147_1: R147.1 U11.19(CLKoutB1)
NetR147_2: R147.2 R150.1
NetR148_1: R148.1 U11.18(CLKoutB1*)
NetR148_2: R148.2 R149.1

Not connected (* = marked no-connect by the designer): U11 25(NC) 26(CLKin1*) 27(CLKin1)

### Notes on the sheet
- To SOC
- To M KEY
- To E KEY
- (in symbol Au5426_device) OUTPUT BANK-A; INPUT SIGNALS; OUTPUT BANK-B; XTAL
- (in symbol radxa_1010) Size; Title:; REV; Page Name:; Date:; Sheet; of

### Library data of the parts
C52 = CAP NP_0: cap,1.00uF,+/-10%,10V,X5R,C0402; Manufacturer: TDK; RK PN: C1005X5R1A105K050BB; Priority: A; Tolerance: 10%; Dielectric: X5R; Part Type: C0402; Manufacturer PN: C1005X5R1A105K050BB; Created by: JJJ
C53 = CAP NP_0: cap,10.00uF,+/-10%,10V,X5R,C0603; Manufacturer PN: C1608X5R1A106K080AC; Manufacturer: TDK; Tolerance: 10%; Priority: A; Dielectric: X5R; Created by: JJJ; Part Type: C0603; RK PN: C1608X5R1A106K080AC
C54 = CAP NP_0: cap,1.00uF,+/-10%,10V,X5R,C0402; Manufacturer PN: C1005X5R1A105K050BB; Manufacturer: TDK; Tolerance: 10%; Priority: A; Dielectric: X5R; Created by: JJJ; Part Type: C0402; RK PN: C1005X5R1A105K050BB
C55 = CAP NP_0: Did Not Place.; RK PN: DNPC0402; Priority: A; Part Type: DNP; Manufacturer PN: DNPC0402; Created by: JJJ
C56 C65 = CAP NP_0: cap,22.00uF,+/-20%,10V,X5R,C0603; Manufacturer PN: C1608X5R1A226M080AC; Manufacturer: TDK; Tolerance: 20%; C_Voltage: 6.3V; Priority: A; Dielectric: X5R; Created by: JJJ; Part Type: C0603; RK PN: C1608X5R1A226M080AC
C57 C58 C61 C63 C66 = CAP NP_0: cap,100.00nF,+/-10%,16V,X5R,C0402; Manufacturer: TDK; Number: 37; RK PN: C1005X5R1C104K050BA; Priority: A; Tolerance: 10%; C_Voltage: 6.3V; Dielectric: X5R; Part Type: C0402; Manufacturer PN: C1005X5R1C104K050BA; Created by: JJJ
C59 C62 = CAP NP_0: cap,22.00uF,+/-20%,10V,X5R,C0603; Manufacturer: TDK; RK PN: C1608X5R1A226M080AC; Priority: A; C_Voltage: 6.3V; Tolerance: 20%; Dielectric: X5R; Part Type: C0603; Manufacturer PN: C1608X5R1A226M080AC; Created by: JJJ
C60 C64 C67 = CAP NP_0: cap,100.00nF,+/-10%,16V,X5R,C0402; Manufacturer PN: C1005X5R1C104K050BA; Manufacturer: TDK; C_Voltage: 6.3V; Tolerance: 10%; Priority: A; Number: 37; Dielectric: X5R; Created by: JJJ; Part Type: C0402; RK PN: C1005X5R1C104K050BA
C68 C70 C73 = CAP NP_Dup1: ManufacturerPN: GCM155R71C104KA55D; Manufacturer: Murata Electronics North America
C69 C71 C72 C74 = CAP NP_Dup1: Manufacturer: Murata Electronics North America; ManufacturerPN: GCM155R71C104KA55D
C75 C78 = CAP NP_Dup1: Manufacturer: Murata Electronics; ManufacturerPN: GCM1555C1H270FA16D; mounting_status: DNP
C76 = CAP NP: 0.1uF,10%,16V,X7R,0402,SMD,YAGEO,CC0402KRX7R7BB104; TGXA Part Num: 1100.000062; Part: 0.1uF_16V_X7R; SIGNAL_MODEL: CAP_NP_C0402_0.1UF_16V_X7R_0.1uF_16V_X7R; Vendor Code: CC0402KRX7R7BB104; Manufacturer: YAGEO; PN: 1100.000062
C77 = CAP NP: 0.1uF,10%,16V,X7R,0402,SMD,YAGEO,CC0402KRX7R7BB104; Part: 0.1uF_16V_X7R; PN: 1100.000062; SIGNAL_MODEL: CAP_NP_C0402_0.1UF_16V_X7R_0.1uF_16V_X7R; Manufacturer: YAGEO; Vendor Code: CC0402KRX7R7BB104; TGXA Part Num: 1100.000062
FB3 = FERRITE BEAD: 贴片磁珠,茂昌,MCCB1608RL120HC060,120R,25%,0.6A,DCR 0.25R,0603,SMD,H0.8mm,-55~125℃ /; TGXA Part Num: 1202.000003; Part: 120R_100MHZ_0.6A; Manufacturer: 茂昌; Vendor Code: MCCB1608RL120HC060; PN: 1202.000003
R116-R119 = RESISTOR_0_Dup1: 通用厚膜电阻,470R,+/-1%,R0402,1/16W.; Manufacturer: YAGEO; RK PN: RC0402FR-07470RL; Priority: A; Wattage: 1/16W; Part Type: 通用厚膜电阻; Manufacturer PN: RC0402FR-07470RL; Created by: YTL
R120 = RESISTOR_0_Dup1: as R8 on sheet 04; Created by: YTL; Part Type: 通用厚膜电阻; RK PN: RC0402JR-0710KL
R121 = RESISTOR_0_Dup1: Did Not Place.; RK PN: DNPR0402; Priority: A; Part Type: DNP; Manufacturer PN: DNPR0402; Created by: JJJ
R122-R125 R140 = RESISTOR_Dup1: ManufacturerPN: ERJ-2GE0R00X; Manufacturer: Panasonic
R126 R139 R145 R146 = RESISTOR_Dup1: Manufacturer: Panasonic; ManufacturerPN: ERJ-2GE0R00X
R127 R128 R131 R136 R137 = RESISTOR_0_Dup1: 通用厚膜电阻,33R,+/-5%,R0201,1/20W.; Manufacturer: YAGEO; Tolerance: 5%; RK PN: RC0201JR-0733RL; Priority: A; Wattage: 1/20W; Part Type: 通用厚膜电阻; Manufacturer PN: RC0201JR-0733RL; Created by: YTL
R129 R130 R141 R143 = RESISTOR_0_Dup1: 通用厚膜电阻,49R9,+/-1%,R0201,1/20W.; Manufacturer PN: RC0201FR-0749R9L; Manufacturer: YAGEO; Wattage: 1/20W; Priority: A; Created by: YTL; Part Type: 通用厚膜电阻; RK PN: RC0201FR-0749R9L
R132 = RESISTOR_0_Dup1: 通用厚膜电阻,33R,+/-5%,R0201,1/20W.; Manufacturer PN: RC0201JR-0733RL; Manufacturer: YAGEO; Tolerance: 5%; Wattage: 1/20W; Priority: A; Created by: YTL; Part Type: 通用厚膜电阻; RK PN: RC0201JR-0733RL
R133 R134 R149 R150 = RESISTOR_0_Dup1: 通用厚膜电阻,49R9,+/-1%,R0201,1/20W.; Manufacturer: YAGEO; RK PN: RC0201FR-0749R9L; Priority: A; Wattage: 1/20W; Part Type: 通用厚膜电阻; Manufacturer PN: RC0201FR-0749R9L; Created by: YTL
R135 R138 R144 = RESISTOR_0_Dup1: 通用厚膜电阻,0R,+/-5%,R0402,1/16W.; Manufacturer PN: RC0402JR-070RL; Manufacturer: YAGEO; Wattage: 1/16W; Priority: A; Created by: YTL; Part Type: 通用厚膜电阻; RK PN: RC0402JR-070RL
R142 = R_4: 33R,5%,1/16W,0402,SMD,YAGEO,RC0402JR-0733RL; TGXA Part Num: 1000.000017; Part: 33_J; Manufacturer: YAGEO; Vendor Code: RC0402JR-0733RL; PN: 1000.000017
R147 R148 = RESISTOR_0_Dup1: 通用厚膜电阻,33R,+/-5%,R0201,1/20W.; Manufacturer PN: RC0201JR-0733RL; Manufacturer: YAGEO; Tolerance: 5%; Wattage: 1/20W; Priority: A; OPTION: DNP; Created by: YTL; Part Type: 通用厚膜电阻; RK PN: RC0201JR-0733RL
U10 = LDO_PT5108: 3.3V Output,300mA, Low Dropout, Low Noise Ultra-Fast Without Bypass Capacitor CMOS LDO Regulator; Manufacturer: Richtek（立錡）; Priority: A; Created by: JJJ; Manufacturer PN: RT9193-33GB; Part Type: LDO; RK PN: RT9193-33GB
U11 = Au5426_device: ManufacturerPN: Au5246; Manufacturer: AURA; mounting_status: DNP
Y1 = 7W50000024_4: 有源晶振,YXC,O3225100MEDH4MI,100MHz,3.3V,LVCMOS,20ppm,3225,SMD; TGXA Part Num: 1601.000008; PN: 1601.000031; Vendor Code: 8E100000018V; Part: 100MHz,3.3V,3225; Manufacturer: YXC
*#7 = radxa_1010: Page Create Date: March  8, 1995